# EasyEDA Pro project BackupProjects_muggle.eprj

# Schematic MSP430_T2_pro
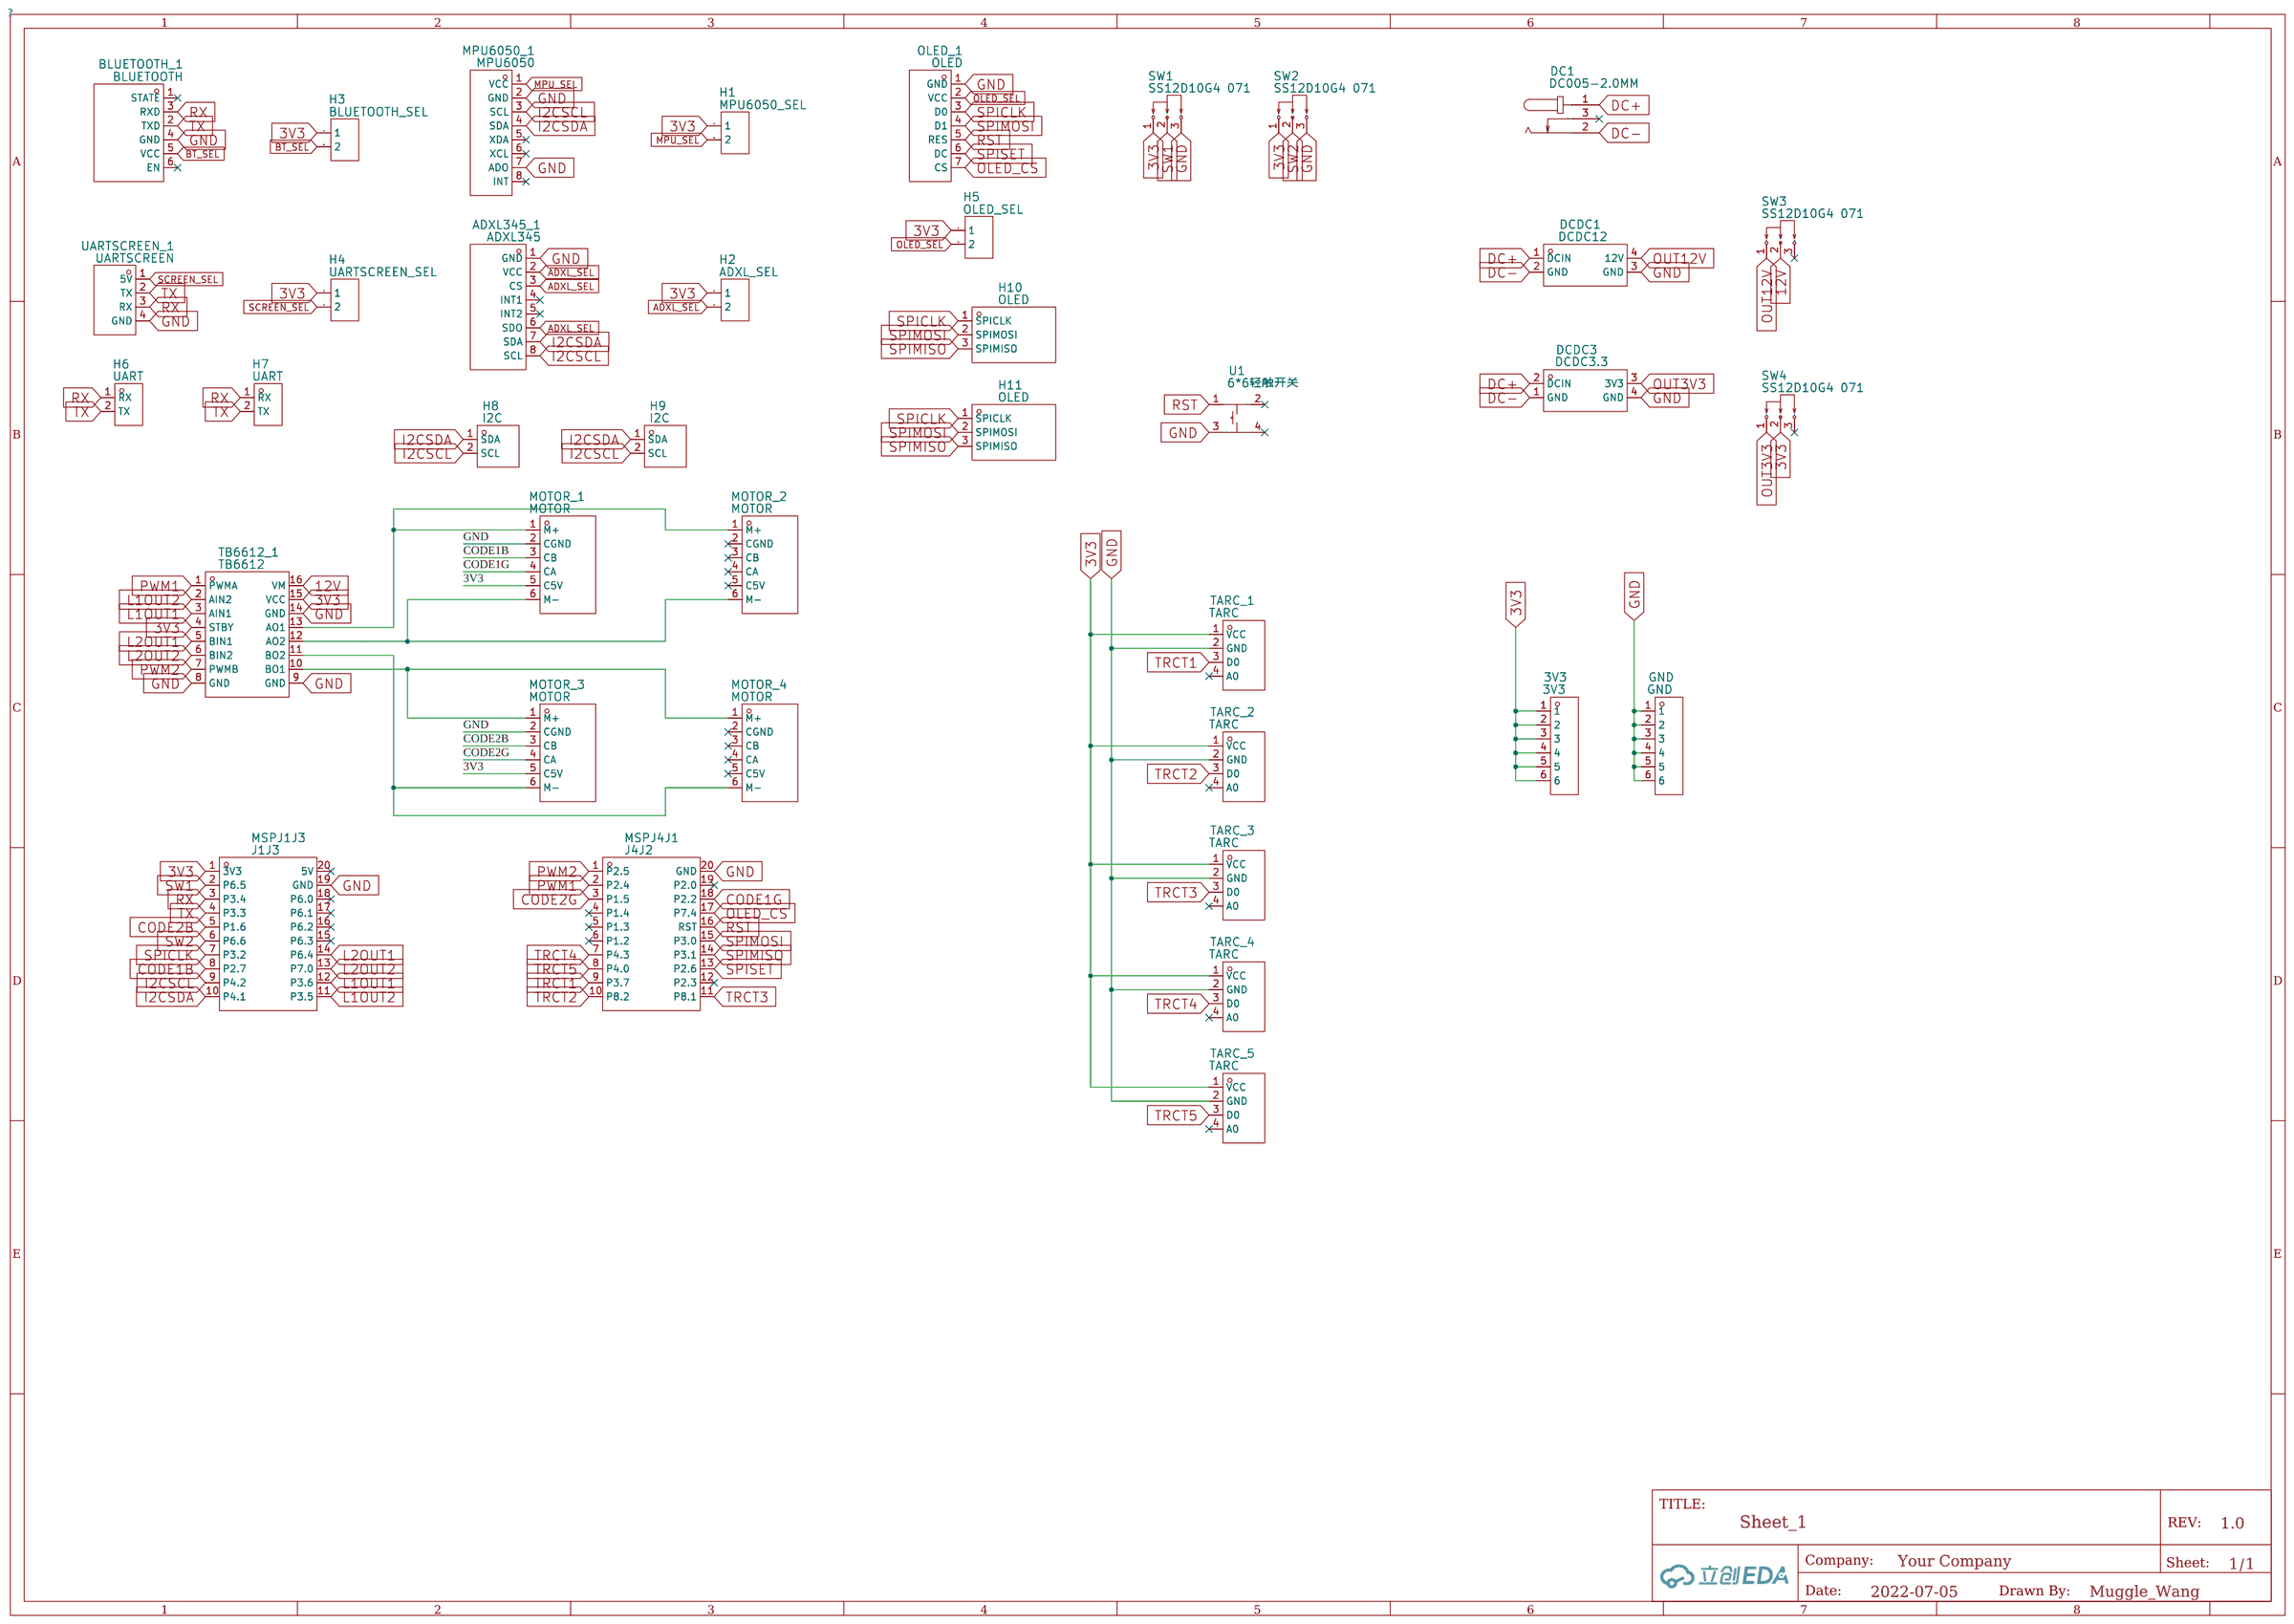
[diagram p0: schematic sheet]

## Parts
3V3  3V3  [DIP-6P]
ADXL345_1  ADXL345  [ADXL345加速度模块]
BLUETOOTH_1  BLUETOOTH  [HC05封装]
DC1  DC005-2.0MM  [DC-IN-TH_DC005-T20]
DCDC1  DCDC12  [15V-12V]
DCDC3  DCDC3.3  [15V-3.3V]
GND  GND  [DIP-6P]
H1  MPU6050_SEL  [HDR-F-2.54_1X2]
H2  ADXL_SEL  [HDR-F-2.54_1X2]
H3  BLUETOOTH_SEL  [HDR-F-2.54_1X2]
H4  UARTSCREEN_SEL  [HDR-F-2.54_1X2]
H5  OLED_SEL  [HDR-F-2.54_1X2]
H6  UART  [UART_2]
H7  UART  [UART_2]
H8  I2C  [DIP-2.54MM-2P]
H9  I2C  [DIP-2.54MM-2P]
H10  OLED  [SPI_3]
H11  OLED  [SPI_3]
MOTOR_1  MOTOR  [MOTOR]
MOTOR_2  MOTOR  [MOTOR]
MOTOR_3  MOTOR  [MOTOR]
MOTOR_4  MOTOR  [MOTOR]
MPU6050_1  MPU6050  [MPU6050模块]
MSPJ1J3  J1J3  [MSP_L]
MSPJ4J1  J4J2  [MSP_R]
OLED_1  OLED  [0.96OLED_7P]
SW1  SS12D10G4 071  [SW-TH_SHOU-HAN_SS12D10G4]
SW2  SS12D10G4 071  [SW-TH_SHOU-HAN_SS12D10G4]
SW3  SS12D10G4 071  [SW-TH_SHOU-HAN_SS12D10G4]
SW4  SS12D10G4 071  [SW-TH_SHOU-HAN_SS12D10G4]
TARC_1  TARC  [TARC]
TARC_2  TARC  [TARC]
TARC_3  TARC  [TARC]
TARC_4  TARC  [TARC]
TARC_5  TARC  [TARC]
TB6612_1  TB6612  [TB6612FNG]
U1  6*6轻触开关  [轻触开关6*6]
UARTSCREEN_1  UARTSCREEN  [UART_SCREEN]

## Library data of the parts
3V3 = 3V3
ADXL345_1 = ADXL345
BLUETOOTH_1 = BLUETOOTH
DC1 = DC005-2.0MM: link: https://atta.szlcsc.com/upload/public/pdf/source/20170519/1495157966733.pdf; Supplier: LCSC; Manufacturer: SOFNG; Supplier Part: C111567; JLCPCB Part Class: ExtendedPart
DCDC1 = DCDC12: link: https://item.szlcsc.com/213063.html
DCDC3 = DCDC3.3: link: https://item.szlcsc.com/213063.html
GND = GND
H1 = MPU6050_SEL: 3DModel: HDR-F-2.54_1x2; Supplier Part: C49661; Supplier: LCSC
H2 = ADXL_SEL: 3DModel: HDR-F-2.54_1x2; Supplier Part: C49661; Supplier: LCSC
H3 = BLUETOOTH_SEL: 3DModel: HDR-F-2.54_1x2; Supplier Part: C49661; Supplier: LCSC
H4 = UARTSCREEN_SEL: 3DModel: HDR-F-2.54_1x2; Supplier Part: C49661; Supplier: LCSC
H5 = OLED_SEL: 3DModel: HDR-F-2.54_1x2; Supplier Part: C49661; Supplier: LCSC
H6 H7 = UART
H8 H9 = I2C
H10 H11 = OLED
MOTOR_1-MOTOR_4 = MOTOR
MPU6050_1 = MPU6050
MSPJ1J3 = J1J3
MSPJ4J1 = J4J2
OLED_1 = OLED: link: https://cn.bing.com/search?q=datasheet：0.96OLED
SW1-SW4 = SS12D10G4 071: link: https://atta.szlcsc.com/upload/public/pdf/source/20210820/80D1704BBF3FCEE0435FCAA54C61E0A3.pdf; Supplier: LCSC; Supplier Part: C2887259; Manufacturer: SHOUHAN(首韩); Manufacturer Part: SS12D10G4071; JLCPCB Part Class: ExtendedPart
TARC_1-TARC_5 = TARC
TB6612_1 = TB6612
U1 = 6*6轻触开关
UARTSCREEN_1 = UARTSCREEN

## Nets
3V3: 3V3.1 3V3.2 3V3.3 3V3.4 3V3.5 3V3.6 H1.1 H2.1 H3.1 H4.1 H5.1 MOTOR_1.5(C5V) MOTOR_3.5(C5V) MSPJ1J3.1(3V3) SW1.1 SW2.1 SW4.2 TARC_1.1(VCC) TARC_2.1(VCC) TARC_3.1(VCC) TARC_4.1(VCC) TARC_5.1(VCC) TB6612_1.4(STBY) TB6612_1.15(VCC)
12V: SW3.2 TB6612_1.16(VM)
GND: ADXL345_1.1(GND) BLUETOOTH_1.4(GND) DCDC1.3(GND) DCDC3.4(GND) GND.1 GND.2 GND.3 GND.4 GND.5 GND.6 MOTOR_1.2(CGND) MOTOR_3.2(CGND) MPU6050_1.2(GND) MPU6050_1.7(ADO) MSPJ1J3.19(GND) MSPJ4J1.20(GND) OLED_1.1(GND) SW1.3 SW2.3 TARC_1.2(GND) TARC_2.2(GND) TARC_3.2(GND) TARC_4.2(GND) TARC_5.2(GND) TB6612_1.8(GND) TB6612_1.9(GND) TB6612_1.14(GND) U1.3 UARTSCREEN_1.4(GND)
ADXL_SEL: ADXL345_1.2(VCC) ADXL345_1.3(CS) ADXL345_1.6(SDO) H2.2
BT_SEL: BLUETOOTH_1.5(VCC) H3.2
CODE1B: MOTOR_1.3(CB) MSPJ1J3.8(P2.7)
CODE1G: MOTOR_1.4(CA) MSPJ4J1.18(P2.2)
CODE2B: MOTOR_3.3(CB) MSPJ1J3.5(P1.6)
CODE2G: MOTOR_3.4(CA) MSPJ4J1.3(P1.5)
DC+: DC1.1 DCDC1.1(DCIN) DCDC3.2(DCIN)
DC-: DC1.2 DCDC1.2(GND) DCDC3.1(GND)
I2CSCL: ADXL345_1.8(SCL) H8.2(SCL) H9.2(SCL) MPU6050_1.3(SCL) MSPJ1J3.9(P4.2)
I2CSDA: ADXL345_1.7(SDA) H8.1(SDA) H9.1(SDA) MPU6050_1.4(SDA) MSPJ1J3.10(P4.1)
L1OUT1: MSPJ1J3.12(P3.6) TB6612_1.3(AIN1)
L1OUT2: MSPJ1J3.11(P3.5) TB6612_1.2(AIN2)
L2OUT1: MSPJ1J3.14(P6.4) TB6612_1.5(BIN1)
L2OUT2: MSPJ1J3.13(P7.0) TB6612_1.6(BIN2)
MPU_SEL: H1.2 MPU6050_1.1(VCC)
OLED_CS: MSPJ4J1.17(P7.4) OLED_1.7(CS)
OLED_SEL: H5.2 OLED_1.2(VCC)
OUT3V3: DCDC3.3(3V3) SW4.1
OUT12V: DCDC1.4(12V) SW3.1
PWM1: MSPJ4J1.2(P2.4) TB6612_1.1(PWMA)
PWM2: MSPJ4J1.1(P2.5) TB6612_1.7(PWMB)
RST: MSPJ4J1.16(RST) OLED_1.5(RES) U1.1
RX: BLUETOOTH_1.3(RXD) H6.1(RX) H7.1(RX) MSPJ1J3.3(P3.4) UARTSCREEN_1.3(RX)
SCREEN_SEL: H4.2 UARTSCREEN_1.1(5V)
SPICLK: H10.1(SPICLK) H11.1(SPICLK) MSPJ1J3.7(P3.2) OLED_1.3(D0)
SPIMISO: H10.3(SPIMISO) H11.3(SPIMISO) MSPJ4J1.14(P3.1)
SPIMOSI: H10.2(SPIMOSI) H11.2(SPIMOSI) MSPJ4J1.15(P3.0) OLED_1.4(D1)
SPISET: MSPJ4J1.13(P2.6) OLED_1.6(DC)
SW1: MSPJ1J3.2(P6.5) SW1.2
SW2: MSPJ1J3.6(P6.6) SW2.2
TRCT1: MSPJ4J1.9(P3.7) TARC_1.3(D0)
TRCT2: MSPJ4J1.10(P8.2) TARC_2.3(D0)
TRCT3: MSPJ4J1.11(P8.1) TARC_3.3(D0)
TRCT4: MSPJ4J1.7(P4.3) TARC_4.3(D0)
TRCT5: MSPJ4J1.8(P4.0) TARC_5.3(D0)
TX: BLUETOOTH_1.2(TXD) H6.2(TX) H7.2(TX) MSPJ1J3.4(P3.3) UARTSCREEN_1.2(TX)
TB6612_1_10: MOTOR_3.1(M+) MOTOR_4.1(M+) TB6612_1.10(BO1)
TB6612_1_11: MOTOR_3.6(M-) MOTOR_4.6(M-) TB6612_1.11(BO2)
TB6612_1_12: MOTOR_1.6(M-) MOTOR_2.6(M-) TB6612_1.12(AO2)
TB6612_1_13: MOTOR_1.1(M+) MOTOR_2.1(M+) TB6612_1.13(AO1)

Not connected (* = marked no-connect by the designer): ADXL345_1 4(INT1)* 5(INT2)*; BLUETOOTH_1 1(STATE)* 6(EN)*; DC1 3*; MOTOR_2 2(CGND)* 3(CB)* 4(CA)* 5(C5V)*; MOTOR_4 2(CGND)* 3(CB)* 4(CA)* 5(C5V)*; MPU6050_1 5(XDA)* 6(XCL)* 8(INT)*; MSPJ1J3 15(P6.3)* 16(P6.2)* 17(P6.1)* 18(P6.0)* 20(5V)*; MSPJ4J1 4(P1.4)* 5(P1.3)* 6(P1.2)* 12(P2.3)* 19(P2.0)*; SW3 3*; SW4 3*; TARC_1 4(A0)*; TARC_2 4(A0)*; TARC_3 4(A0)*; TARC_4 4(A0)*; TARC_5 4(A0)*; U1 2* 4*

# Board 1-PCB_PCB_MSP430_T2 copy
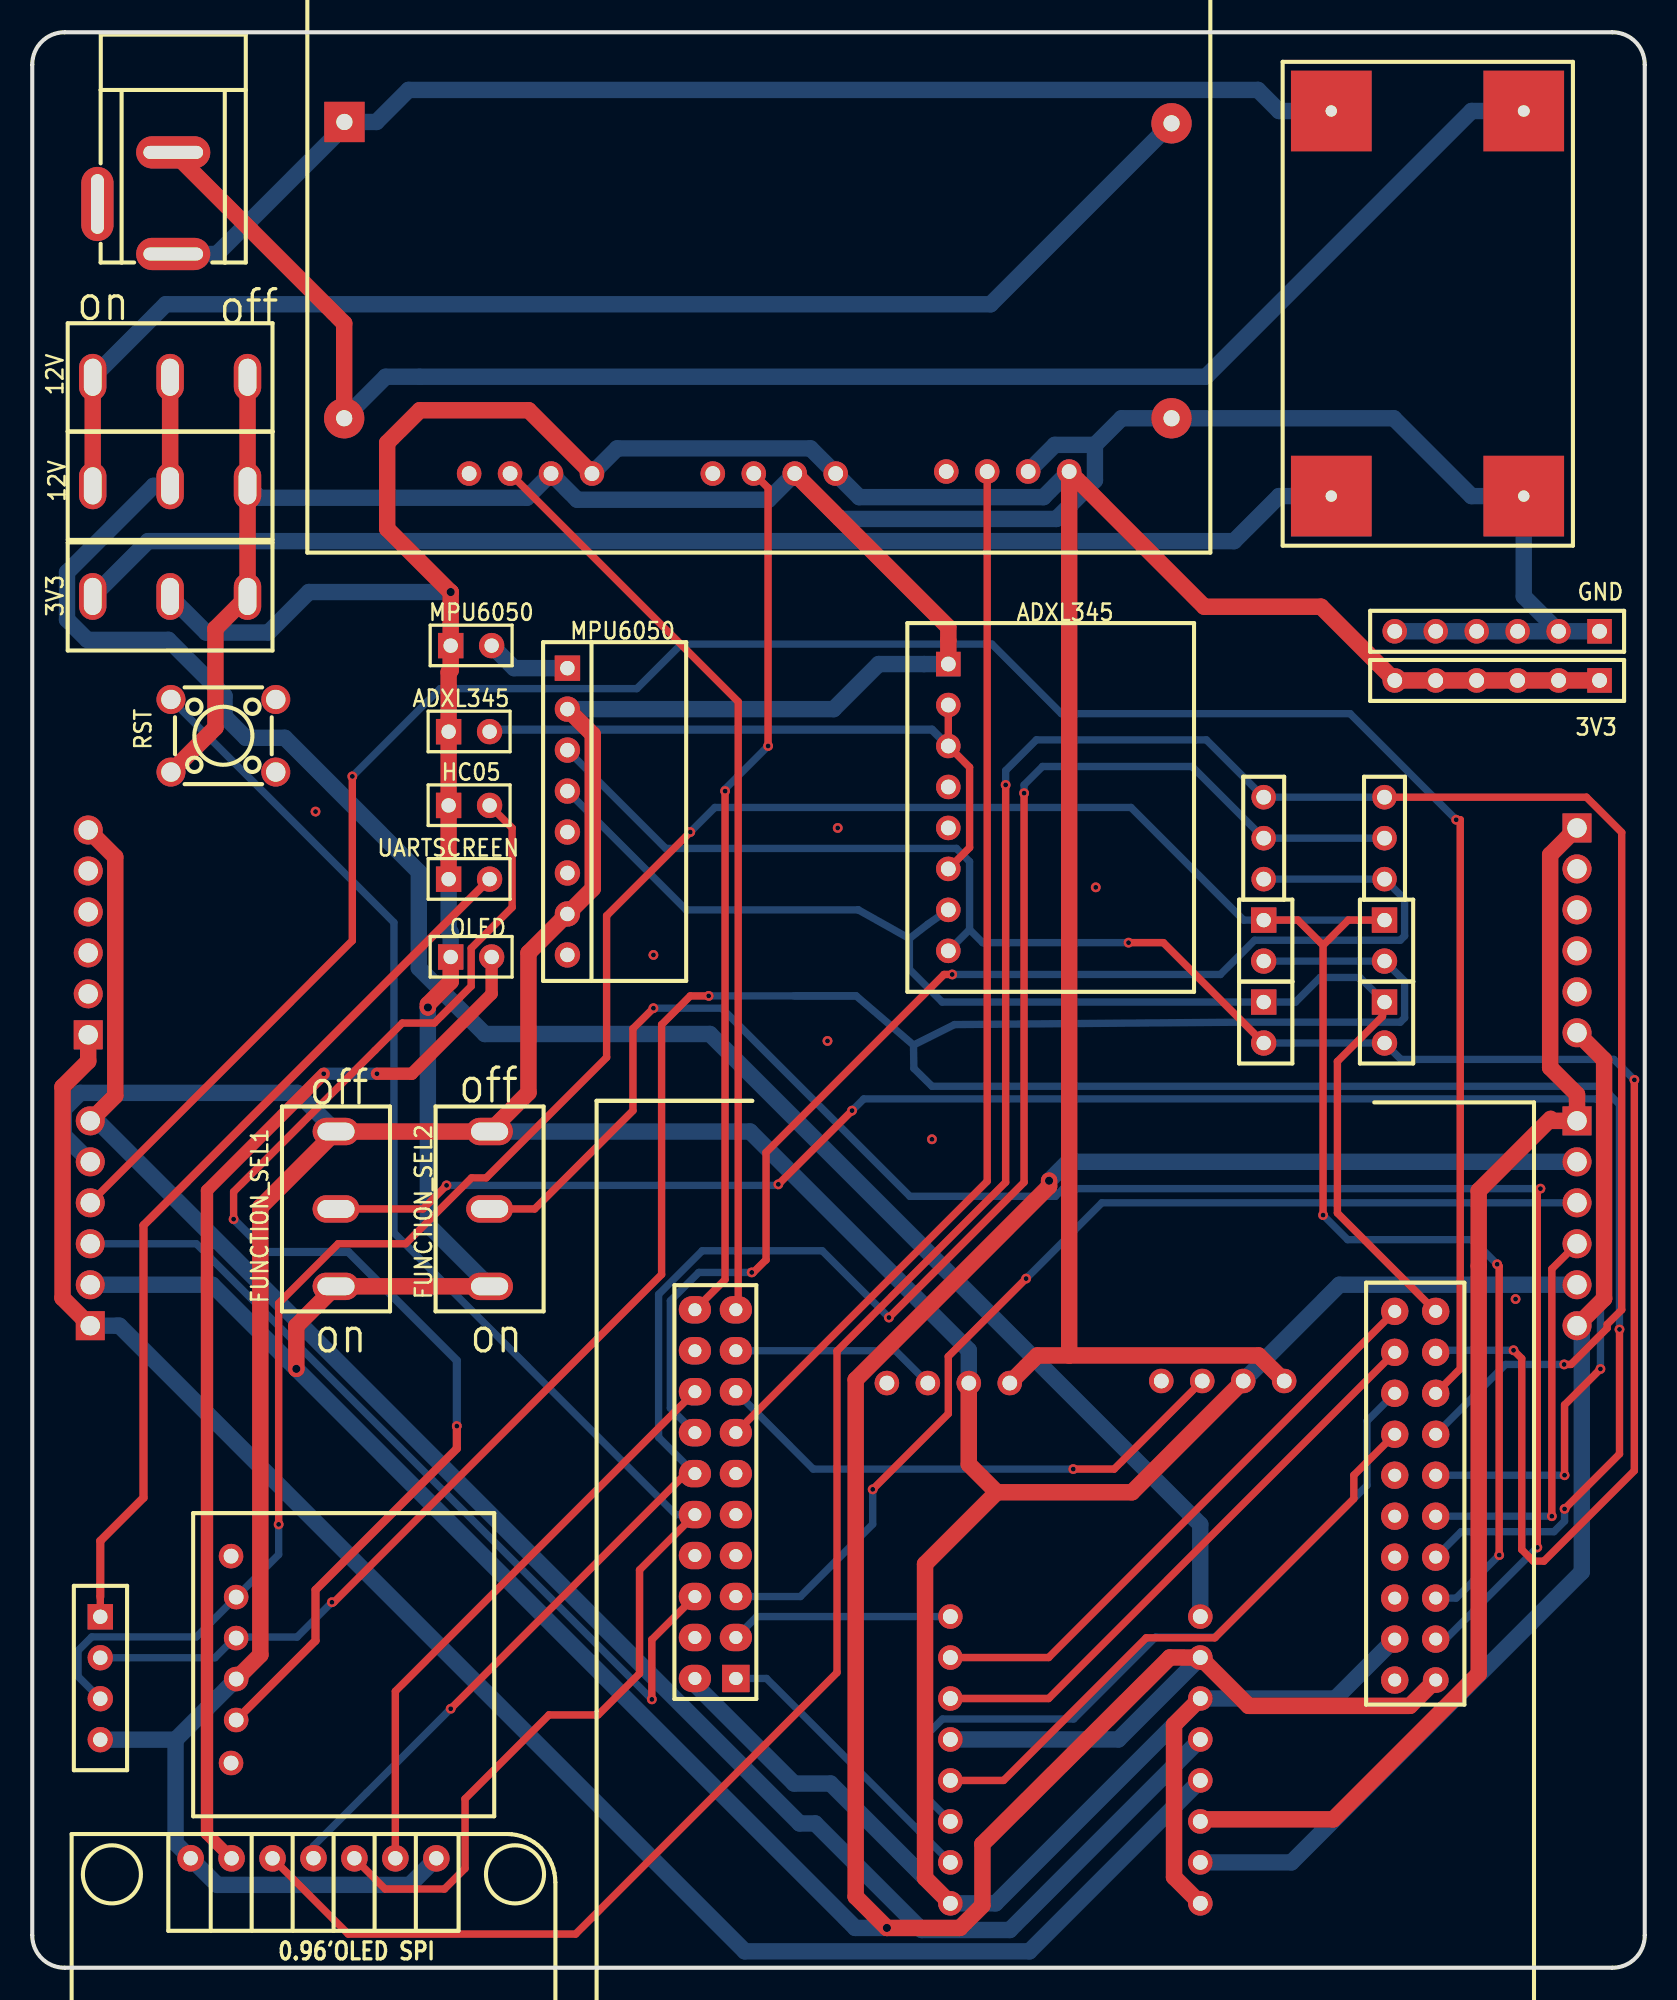
[diagram p1: board, top side]
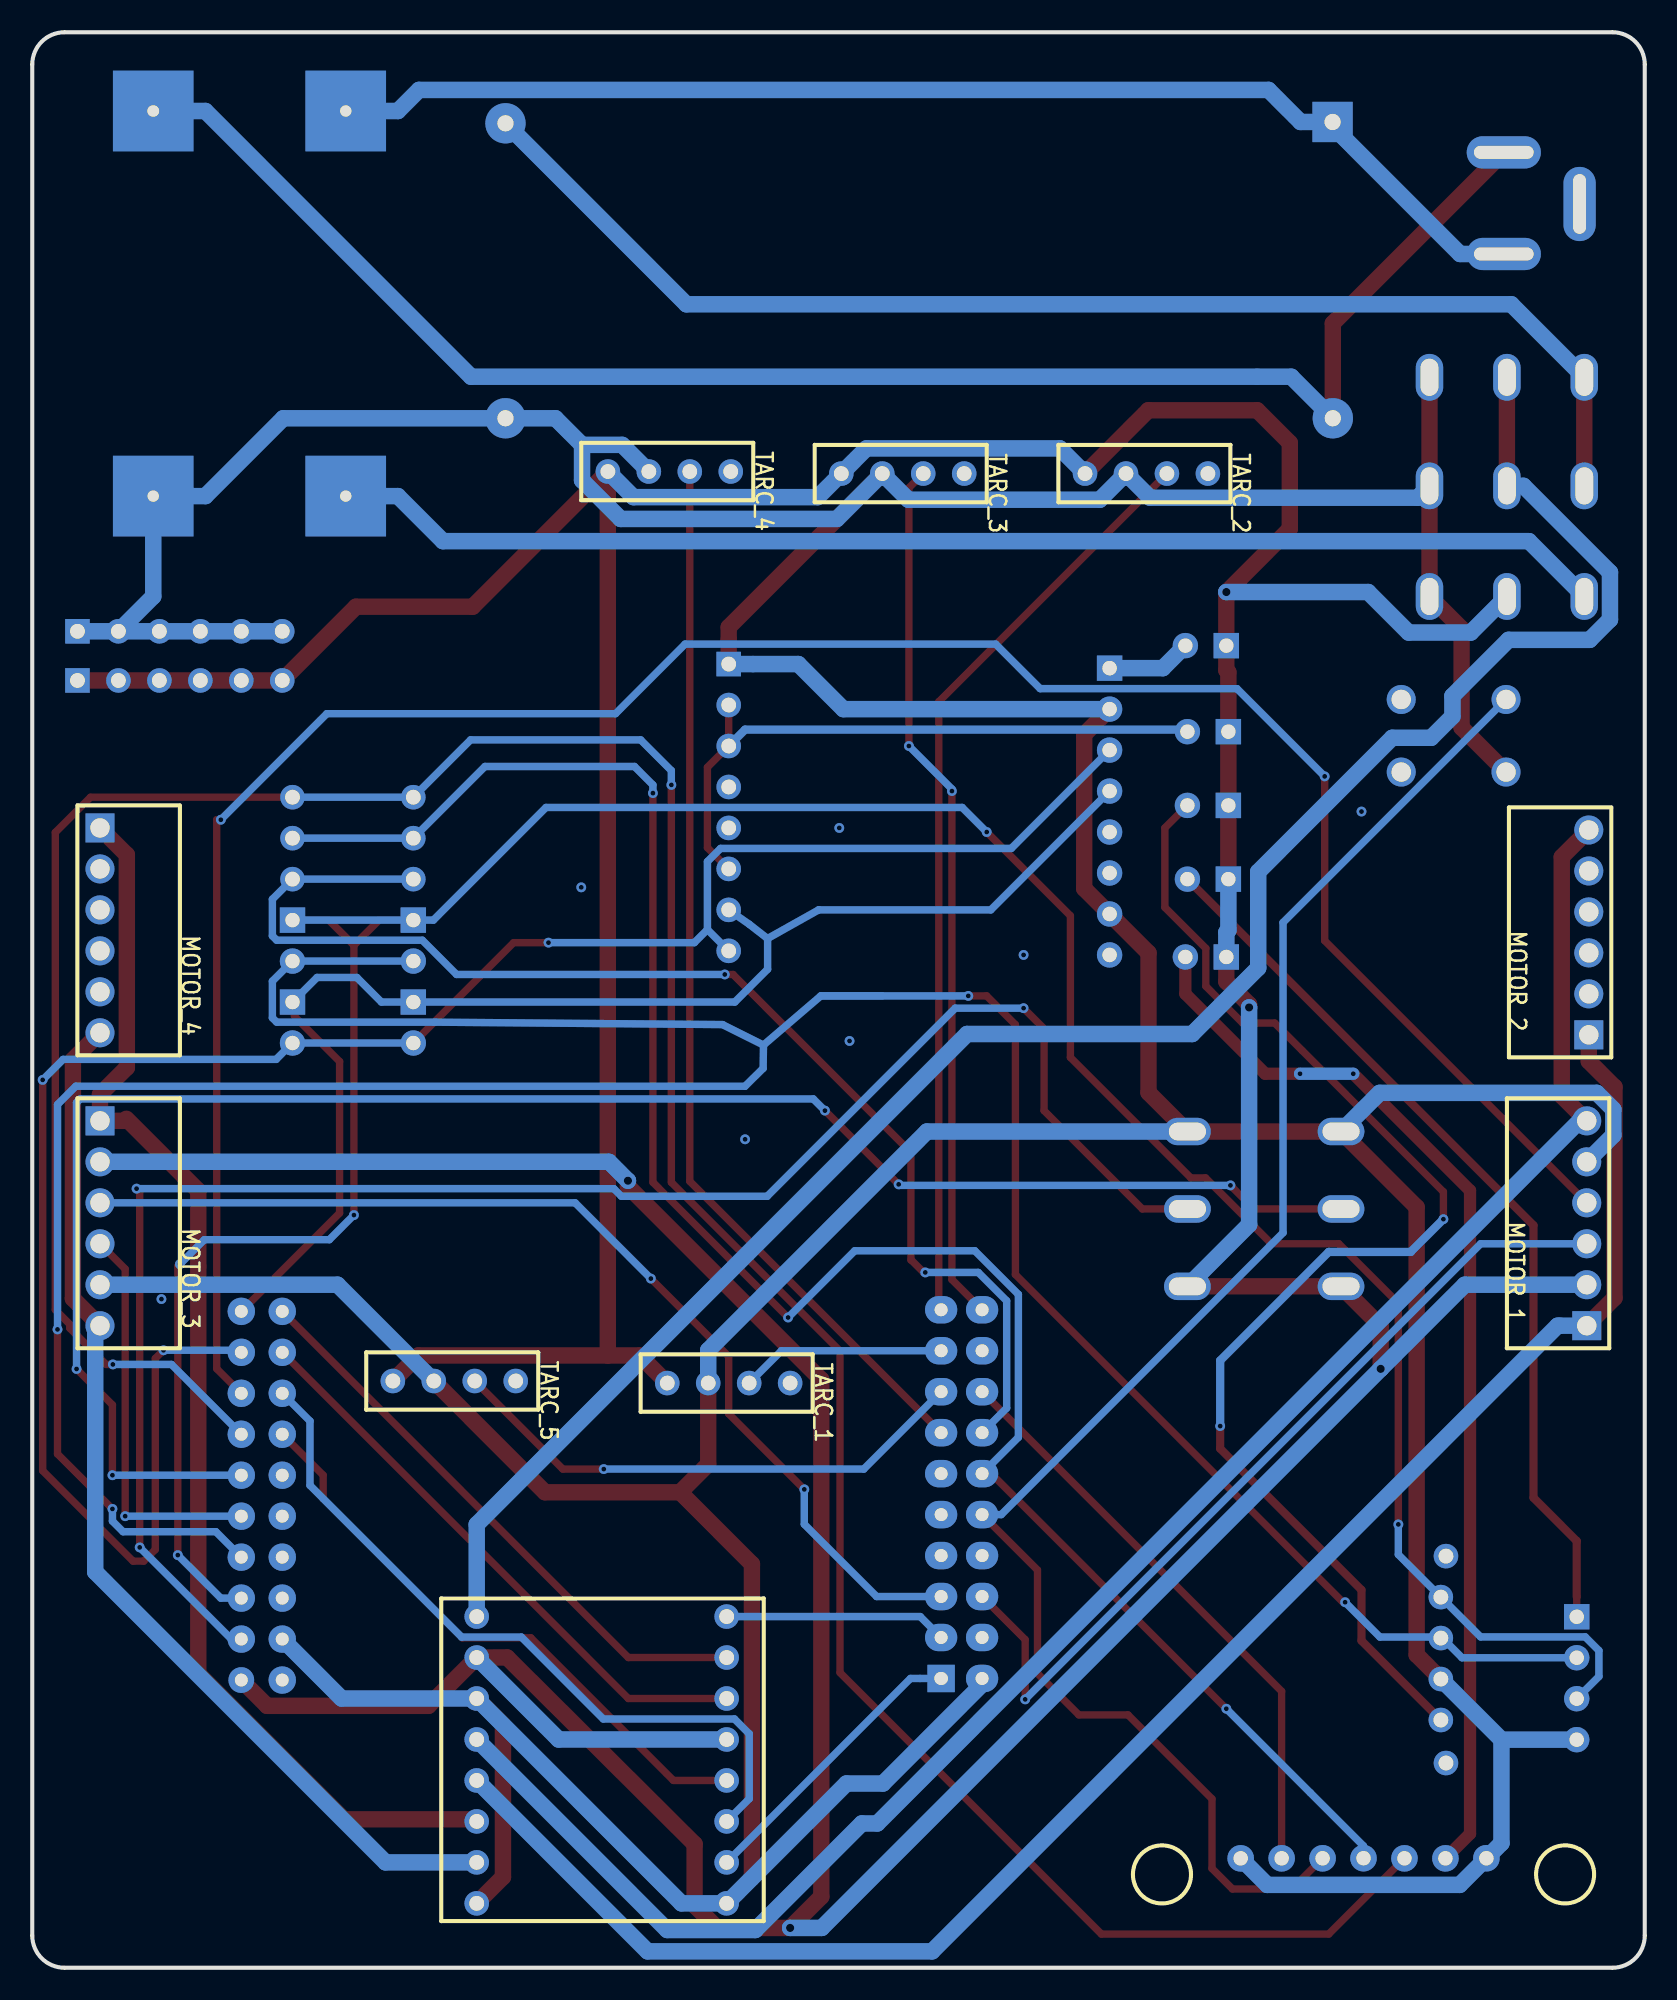
[diagram p2: board, bottom side, seen from below]

Outline 100 x 120 mm; copper layers: Top Layer, Bottom Layer. Coordinates in mm from the lower left corner of the outline.
Outline path: 0,118 arc(0.59,119.41) 2,120 98,120 arc(99.41,119.41) 100,118 100,2 arc(99.41,0.59) 98,0 2,0 arc(0.59,0.59) 0,2 0,118
Stack: Top Layer 0.035mm / Dielectric1 1.51mm FR4 er 4.5 / Bottom Layer 0.035mm

## Design rules (mm)
spacing Default (default): track to track 0.229, other pairs 0 to 0.229
spacing DY: track to track 0.229, other pairs 0 to 0.229
track width Default (default): min 0.457, default 0.457, max 25.4
track width DY: min 1.016, default 1.016, max 25.4
differential pair differentialPair (default): width min 0.127, default 0.254, max 2.54; gap min 0.152, default 0.152
via Default (default): diameter min 0.61, default 0.61, max 100.025; hole min 0.305, default 0.305, max 59.995
via DY: diameter min 0.61, default 0.61, max 100.025; hole min 0.305, default 0.305, max 59.995
net 3V3 uses DY
net TB6612_1_13 uses DY
net GND uses DY, gge38530
net 12V uses DY
net TB6612_1_11 uses DY
net TB6612_1_10 uses DY
net TB6612_1_12 uses DY
net OUT12V uses DY
net DC- uses DY
net OUT3V3 uses DY
net DC+ uses DY
pour e292 uses gge38542
pour e530 uses gge38530

## Placement (name value [footprint] x y rotation side)
3V3  3V3  [DIP-6P]  89.58 79.81 180 top
3V3#2  -  [SW-TH_SHOU-HAN_SS12D10G4]  8.55 85.02 0 top
12V  -  [SW-TH_SHOU-HAN_SS12D10G4]  8.55 98.61 0 top
12V#2  -  [SW-TH_SHOU-HAN_SS12D10G4]  8.55 91.88 0 top
ADXL345  -  [ADXL345加速度模块]  54.27 83.37 0 top
ADXL345#2  -  [HDR-F-2.54_1X2]  27.09 76.64 0 top
BLUETOOTH_1  BLUETOOTH  [HC05封装]  12.49 19.11 0 top
DC1  DC005-2.0MM  [DC-IN-TH_DC005-T20]  6.39 109.4 270 top
DCDC1  DCDC12  [15V-12V]  17.06 122.74 0 top
DCDC3  DCDC3.3  [15V-3.3V]  83.86 104.45 270 top
FUNCTION_SEL1  SS12D10G4 071  [SW-TH_SHOU-HAN_SS12D10G4]  18.84 47.05 90 top
FUNCTION_SEL2  SS12D10G4 071  [SW-TH_SHOU-HAN_SS12D10G4]  28.36 47.05 90 top
GND  GND  [DIP-6P]  89.58 82.86 180 top
H6  UART  [UART_2]  76.37 63.68 270 top
H7  UART  [UART_2]  83.86 63.68 270 top
H8  I2C  [DIP-2.54MM-2P]  76.37 58.6 270 top
H9  I2C  [DIP-2.54MM-2P]  83.86 58.6 270 top
H10  OLED  [SPI_3]  76.37 70.03 270 top
H11  OLED  [SPI_3]  83.86 70.03 270 top
HC05  BLUETOOTH_SEL  [HDR-F-2.54_1X2]  27.09 72.06 0 top
MOTOR_1  -  [MOTOR]  3.6 46.16 270 bottom
MOTOR_2  -  [MOTOR]  3.47 64.19 270 bottom
MOTOR_3  -  [MOTOR]  95.8 46.16 90 bottom
MOTOR_4  -  [MOTOR]  95.8 64.32 90 bottom
MPU6050  -  [HDR-F-2.54_1X2]  27.22 81.97 0 top
MPU6050#2  -  [MPU6050模块]  33.19 62.79 0 top
MSPJ1J3  J1J3  [MSP_L]  83.23 29.27 180 top
MSPJ4J1  J4J2  [MSP_R]  43.63 17.94 180 top
OLED  OLED_SEL  [HDR-F-2.54_1X2]  27.22 62.67 0 top
OLED_1  OLED  [0.96OLED_7P]  17.44 6.79 0 top
RST  6*6轻触开关  [轻触开关6*6]  11.85 76.38 0 top
TARC_1  -  [TARC]  56.81 36.25 90 bottom
TARC_2  -  [TARC]  30.9 92.64 90 bottom
TARC_3  -  [TARC]  46.01 92.64 90 bottom
TARC_4  -  [TARC]  60.49 92.77 90 bottom
TARC_5  -  [TARC]  73.83 36.38 90 bottom
TB6612_1  TB6612  [TB6612FNG]  56.94 3.99 0 bottom
UARTSCREEN  UARTSCREEN_SEL  [HDR-F-2.54_1X2]  27.09 67.49 0 top
UARTSCREEN_1  UARTSCREEN  [UART_SCREEN]  3.85 18.34 0 top

## Footprints (pads in the part's own frame, mm; a bottom-side part is the same pattern mirrored in y, then rotated)
0.96OLED_7P
  round 1.65 hole 0.89: 1(-7.619,0.002) 2(-5.079,-0.004) 3(-2.538,-0.004) 4(0.002,0.004) 5(2.538,-0.002) 6(5.079,-0.002) 7(7.619,-0.004)
15V-3.3V
  rect 5x5 hole 0.7: 1(-10.668,-3.302) 3(13.208,8.636) 4(13.208,-3.302)
  rect 5x5 hole 0.7x0.735: 2(-10.668,8.636)
15V-12V
  rect 2.5x2.5 hole 1: 1(2.3,-8.3)
  round 2.5 hole 1: 2(2.286,-26.67) 3(53.594,-26.67) 4(53.594,-8.382)
ADXL345加速度模块
  rect 1.524x1.524 hole 0.914: 1(2.54,-2.54)
  round 1.524 hole 0.914: 2(2.54,-5.08) 3(2.54,-7.62) 4(2.54,-10.16) 5(2.54,-12.7) 6(2.54,-15.24) 7(2.54,-17.78) 8(2.54,-20.32)
DC-IN-TH_DC005-T20
  oval 2x4.6 hole 0.8x3.7: 1(3.15,2.35) 2(-3.15,2.35)
  oval 4.6x2 hole 3.7x0.8: 3(0.05,-2.35)
DIP-2.54MM-2P
  rect 1.575x1.575 hole 0.889: 1(-1.27,0)
  round 1.575 hole 0.889: 2(1.27,0)
DIP-6P
  rect 1.524x1.524 hole 0.914: 1(-7.62,0)
  round 1.524 hole 0.914: 2(-5.08,0) 3(-2.54,0) 4(0,0) 5(2.54,0) 6(5.08,0)
HC05封装
  round 1.524 hole 0.914: 1(-0.159,6.413) 2(0.159,3.873) 3(0.159,1.333) 4(0.159,-1.206) 5(0.159,-3.747) 6(-0.159,-6.413)
HDR-F-2.54_1X2
  rect 1.575x1.575 hole 0.889: 1(-1.27,0)
  round 1.575 hole 0.889: 2(1.27,0)
MOTOR
  round 1.8 hole 1.2: 1(-6.35,0) 2(-3.81,0) 3(-1.27,0) 4(1.27,0) 5(3.81,0)
  rect 1.8x1.8 hole 1.2: 6(6.35,0)
MPU6050模块
  rect 1.575x1.575 hole 0.889x0.894: 1(0,17.78)
  round 1.575 hole 0.889x0.894: 2(0,15.24) 3(0,12.7) 4(0,10.16) 5(0,7.62) 6(0,5.08) 7(0,2.54) 8(0,0)
MSP_L
  round 1.6 hole 0.8: 1(-3.81,11.43)
  round 1.7 hole 0.8: 2(-3.81,8.89) 3(-3.81,6.35) 4(-3.81,3.81) 5(-3.81,1.27) 6(-3.81,-1.27) 7(-3.81,-3.81) 8(-3.81,-6.35) 9(-3.81,-8.89) 10(-3.81,-11.43) 11(-1.27,-11.43) 12(-1.27,-8.89) 13(-1.27,-6.35) 14(-1.27,-3.81) 15(-1.27,-1.27) 16(-1.27,1.27) 17(-1.27,3.81) 18(-1.27,6.35) 19(-1.27,8.89) 20(-1.27,11.43)
MSP_R
  rect 1.7x1.7 hole 0.84x0.8: 1(0,0)
  oval 2x1.7 hole 0.805x0.8: 2(0,-2.54) 3(0,-5.08) 4(0,-7.62) 5(0,-10.16) 6(0,-12.7) 7(0,-15.24) 8(0,-17.78) 9(0,-20.32) 10(0,-22.86) 11(2.54,-22.86) 12(2.54,-20.32) 13(2.54,-17.78) 14(2.54,-15.24) 15(2.54,-12.7) 16(2.54,-10.16) 17(2.54,-7.62) 18(2.54,-5.08) 19(2.54,-2.54) 20(2.54,0)
SPI_3
  round 1.524 hole 0.914: 1(-2.54,0) 2(0,0) 3(2.54,0)
SW-TH_SHOU-HAN_SS12D10G4
  oval 1.7x2.9 hole 1.1x2.3: 1(-4.8,0) 2(0,0) 3(4.8,0)
TARC
  round 1.524 hole 0.914: 1(0,3.81) 2(0,1.27) 3(0,-1.27) 4(0,-3.81)
TB6612FNG
  round 1.524 hole 0.919x0.914: 1(0,-17.78) 2(0,-15.24) 3(0,-12.7) 4(0,-10.16) 5(0,-7.62) 6(0,-5.08) 7(0,-2.54) 8(0,0) 9(15.5,0) 10(15.5,-2.54) 11(15.5,-5.08) 12(15.5,-7.62) 13(15.5,-10.16) 14(15.5,-12.7) 15(15.5,-15.24) 16(15.5,-17.78)
UART_2
  rect 1.575x1.575 hole 0.889: 1(-1.27,0)
  round 1.575 hole 0.889: 2(1.27,0)
UART_SCREEN
  rect 1.575x1.575 hole 0.889: 1(0.368,3.417)
  round 1.575 hole 0.889: 2(0.368,0.876) 3(0.368,-1.663) 4(0.368,-4.204)
轻触开关6*6
  round 1.8 hole 1.2: 1(-3.25,2.25) 2(3.25,2.25) 3(-3.25,-2.25) 4(3.25,-2.25)

## Nets
3V3: 3V3.1 3V3.2 3V3.3 3V3.4 3V3.5 3V3.6 3V3#2.2 ADXL345#2.1 FUNCTION_SEL1.1 FUNCTION_SEL2.1 HC05.1 MOTOR_1.5 MOTOR_3.5 MPU6050.1 MSPJ1J3.1 OLED.1 TARC_1.1 TARC_2.1 TARC_3.1 TARC_4.1 TARC_5.1 TB6612_1.4 TB6612_1.15 UARTSCREEN.1
12V: 12V.2 12V#2.2 TB6612_1.16
GND: 3V3#2.3 12V.3 12V#2.3 ADXL345.1 BLUETOOTH_1.4 DCDC1.3 DCDC3.3 FUNCTION_SEL1.3 FUNCTION_SEL2.3 GND.1 GND.2 GND.3 GND.4 GND.5 GND.6 MOTOR_1.2 MOTOR_3.2 MPU6050#2.2 MPU6050#2.7 MSPJ1J3.19 MSPJ4J1.20 OLED_1.1 OLED_1.7 RST.3 TARC_1.2 TARC_2.2 TARC_3.2 TARC_4.2 TARC_5.2 TB6612_1.8 TB6612_1.9 TB6612_1.14 UARTSCREEN_1.4
ADXL_SEL: ADXL345.2 ADXL345.3 ADXL345.6 ADXL345#2.2
BT_SEL: BLUETOOTH_1.5 HC05.2
CODE1B: MOTOR_1.3 MSPJ1J3.8
CODE1G: MOTOR_1.4 MSPJ4J1.18
CODE2B: MOTOR_3.3 MSPJ1J3.5
CODE2G: MOTOR_3.4 MSPJ4J1.3
DC+: DC1.1 DCDC1.1 DCDC3.1
DC-: DC1.2 DCDC1.2 DCDC3.2
I2CSCL: ADXL345.8 H8.2 H9.2 MPU6050#2.3 MSPJ1J3.9
I2CSDA: ADXL345.7 H8.1 H9.1 MPU6050#2.4 MSPJ1J3.10
L1OUT1: MSPJ1J3.12 TB6612_1.3
L1OUT2: MSPJ1J3.11 TB6612_1.2
L2OUT1: MSPJ1J3.14 TB6612_1.5
L2OUT2: MSPJ1J3.13 TB6612_1.6
MPU_SEL: MPU6050.2 MPU6050#2.1
OLED_SEL: OLED.2 OLED_1.2
OUT3V3: 3V3#2.1 DCDC3.4
OUT12V: 12V.1 12V#2.1 DCDC1.4
PWM1: MSPJ4J1.2 TB6612_1.1
PWM2: MSPJ4J1.1 TB6612_1.7
RST: MSPJ4J1.16 OLED_1.5 RST.1
RX: BLUETOOTH_1.2 H6.1 H7.1 MSPJ1J3.3 UARTSCREEN_1.3
SCREEN_SEL: UARTSCREEN.2 UARTSCREEN_1.1
SPICLK: H10.1 H11.1 MSPJ1J3.7 OLED_1.3
SPIMISO: H10.3 H11.3 MSPJ4J1.14
SPIMOSI: H10.2 H11.2 MSPJ4J1.15 OLED_1.4
SPISET: MSPJ4J1.13 OLED_1.6
SW1: FUNCTION_SEL2.2 MSPJ1J3.2
SW2: FUNCTION_SEL1.2 MSPJ1J3.6
TB6612_1_10: MOTOR_3.1 MOTOR_4.1 TB6612_1.10
TB6612_1_11: MOTOR_3.6 MOTOR_4.6 TB6612_1.11
TB6612_1_12: MOTOR_1.6 MOTOR_2.6 TB6612_1.12
TB6612_1_13: MOTOR_1.1 MOTOR_2.1 TB6612_1.13
TRCT1: MSPJ4J1.9 TARC_1.3
TRCT2: MSPJ4J1.10 TARC_2.3
TRCT3: MSPJ4J1.11 TARC_3.3
TRCT4: MSPJ4J1.7 TARC_4.3
TRCT5: MSPJ4J1.8 TARC_5.3
TX: BLUETOOTH_1.3 H6.2 H7.2 MSPJ1J3.4 UARTSCREEN_1.2

Pads without a net: ADXL345 4 5; BLUETOOTH_1 1 6; DC1 3; MOTOR_2 2 3 4 5; MOTOR_4 2 3 4 5; MPU6050#2 5 6 8; MSPJ1J3 15 16 17 18 20; MSPJ4J1 4 5 6 12 17 19; RST 2 4; TARC_1 4; TARC_2 4; TARC_3 4; TARC_4 4; TARC_5 4

## Via types
v1: diameter 1.016, hole 0.508, Top Layer to Bottom Layer, 5 vias
v2: diameter 0.61, hole 0.305, Top Layer to Bottom Layer, 47 vias

## Routing (per net, layer and track width the routed paths; a pad name or vN(x,y) marks a point on that pad's centre or on a via; arc(x,y) is an arc through that point)
3V3: length 463.9
  Top Layer w1.016: MSPJ1J3.1 85.44,16.24 75.43,16.24 TB6612_1.15 70.55,19.24 58.92,7.67 58.92,3.86 57.53,2.47 v1(53,2.47) 51.07,4.4 51.07,36.46 63.06,48.45 v1(63.06,48.8) ; 64.31,37.96 76.05,37.96 TARC_5.1 ; 64.31,37.96 64.31,92.76 TARC_4.1 72.69,84.38 79.92,84.38 3V3.6 3V3.5 3V3.4 3V3.3 3V3.2 3V3.1 ; 64.31,37.96 62.33,37.96 TARC_1.1 ; TARC_2.1 30.79,96.56 24.03,96.56 22.01,94.54 22.01,89.21 25.95,85.27 MPU6050.1 25.95,80.45 25.82,80.32 ADXL345#2.1 HC05.1 UARTSCREEN.1 ; FUNCTION_SEL2.1 FUNCTION_SEL1.1 16.38,39.79 v1(16.38,37.13) ; OLED.1 25.95,61.14 24.54,59.73 v1(24.54,59.54)
  Bottom Layer w1.016: TARC_4.1 62.71,91.18 51.29,91.18 TARC_3.1 48.26,94.2 36.27,94.2 TARC_2.1 ; TB6612_1.15 67.36,14.15 TB6612_1.4 ; v1(53,2.47) 51.04,2.47 v1(16.38,37.13) 11.16,42.35 MOTOR_1.5 ; v1(24.54,59.54) 24.54,46.07 FUNCTION_SEL2.1 ; MOTOR_3.5 64.23,49.97 v1(63.06,48.8) ; v1(25.95,85.29) 17.15,85.29 14.64,82.78 10.79,82.78 3V3#2.2 ; OLED.1 25.95,64.19 25.82,64.32 UARTSCREEN.1
12V: length 121.7
  Top Layer w1.016: 12V#2.2 12V.2
  Bottom Layer w1.016: TB6612_1.16 72.44,27.48 42.03,57.89 28.07,57.89 23.97,61.99 23.97,67.94 15.66,76.26 13.25,76.26 11.93,77.58 11.93,78.85 8.45,82.33 3.41,82.33 2.16,83.58 2.16,86.52 7.52,91.88 12V#2.2
GND: length 498.7
  Top Layer w1.016: TB6612_1.14 70.81,15.06 70.81,5.62 TB6612_1.9 ; MPU6050#2.2 34.76,76.46 34.76,66.91 MPU6050#2.7 30.78,62.92 30.78,54.26 FUNCTION_SEL2.3 FUNCTION_SEL1.3 14.15,47.16 14.15,19.4 BLUETOOTH_1.4 ; 12V.3 12V#2.3 3V3#2.3 11.36,83.03 11.36,76.89 RST.3 ; TARC_1.2 58.08,31.22 59.82,29.48 ; 59.82,29.48 55.37,25.03 55.37,5.56 TB6612_1.8 ; 59.82,29.48 68.2,29.48 TARC_5.2 ; TARC_3.2 56.81,83.11 56.81,82.33 ; ADXL345.1 56.81,82.33
  Bottom Layer w1.016: OLED_1.1 8.89,7.72 8.89,14.14 ; 65.9,94.42 63.41,94.42 TARC_4.2 ; 65.9,94.42 67.56,96.07 DCDC1.3 84.43,96.07 89.26,91.24 DCDC3.3 92.5,85.02 GND.2 ; 65.9,94.42 65.9,92.22 63.51,89.82 50.1,89.82 TARC_3.2 45.66,91.02 33.8,91.02 TARC_2.2 30.67,91.14 14.09,91.14 12V#2.3 ; 25.06,6.78 23.41,5.14 11.47,5.14 9.82,6.79 ; FUNCTION_SEL2.3 44.52,51.85 58.08,38.28 TARC_1.2 ; TARC_5.2 81.07,42.35 MOTOR_3.2 ; GND.1 GND.2 ; GND.2 GND.3 GND.4 GND.5 GND.6 ; MPU6050#2.2 49.7,78.03 52.49,80.83 55.31,80.83 ; MOTOR_1.2 1.95,51.61 1.95,53.22 2.97,54.24 16.44,54.24 FUNCTION_SEL1.3 ; 8.89,14.14 BLUETOOTH_1.4 ; 8.89,14.14 UARTSCREEN_1.4 ; ADXL345.1 55.31,80.83 ; MSPJ4J1.20 41.09,17.57 47.24,11.42 49.51,11.42 TB6612_1.8 59.74,3.99 TB6612_1.14 80.81,16.69 MSPJ1J3.19
  vias: v2(17.57,71.68) v2(38.52,62.79) v2(49.32,57.46) v2(49.95,70.67) v2(55.79,51.36) v2(65.95,66.98) v2(91.99,41.46)
ADXL_SEL: length 40.2
  Top Layer w0.457: ADXL345.6 58.13,69.45 58.13,74.43 ADXL345.3 ADXL345.2
  Bottom Layer w0.508: ADXL345.3 55.79,76.76 28.49,76.76 ADXL345#2.2
BT_SEL: length 80
  Top Layer w0.457: HC05.2 29.76,70.67 29.76,65.74 27.22,63.2 27.22,60.85 24.94,58.57 22.95,58.57 12.49,48.11 v2(12.49,46.41)
  Top Layer w0.508: BLUETOOTH_1.5 17.57,20.28 17.57,23.42 26.33,32.19 v2(26.33,33.58)
  Bottom Layer w0.508: v2(26.33,33.58) 26.33,37.65 19.6,44.38 14.52,44.38 v2(12.49,46.41)
CODE1B: length 146
  Top Layer w0.457: 3.6,47.43 19.85,63.68 v2(19.85,73.86) ; MSPJ1J3.8 88.56,37.14 88.56,71.18 v2(88.31,71.18)
  Bottom Layer w0.457: v2(19.85,73.86) 25.29,79.3 37.49,79.3 40.25,82.06 59.51,82.06 63.82,77.75 81.73,77.75 v2(88.31,71.18)
CODE1G: length 54
  Top Layer w0.457: v2(38.42,16.64) 38.42,20.34 MSPJ4J1.18
  Bottom Layer w0.457: MOTOR_1.4 10.18,44.89 v2(38.42,16.64)
CODE2B: length 24.7
  Top Layer w0.457: MOTOR_3.3 94.24,43.33 v2(94.24,28)
  Bottom Layer w0.457: v2(94.24,28) MSPJ1J3.5
CODE2G: length 65.6
  Top Layer w0.457: v2(61.64,42.73) 56.81,37.9 56.81,34.35 v2(52.12,29.66)
  Bottom Layer w0.457: 52.12,29.66 52.12,27.5 47.64,23.01 MSPJ4J1.3 ; 95.8,47.43 66.34,47.43 v2(61.64,42.73)
DC+: length 76.9
  Bottom Layer w1.016: 19.64,114.44 21.35,114.44 23.33,116.43 76.01,116.43 77.32,115.12 DCDC3.1 ; 19.64,114.44 DCDC1.1 ; 19.64,114.44 11.45,106.25 DC1.1
DC-: length 101.9
  Top Layer w1.016: DCDC1.2 19.34,101.95 8.74,112.55
  Bottom Layer w1.016: DCDC3.2 89.26,115.12 72.78,98.64 21.92,98.64 DCDC1.2
I2CSCL: length 130.3
  Top Layer w0.457: H8.2 70.15,63.56 v2(67.99,63.56) ; v2(99.35,55.05) 99.35,30.82 93.75,25.21 93.09,25.21 92.37,25.93 92.37,37.78 v2(91.86,38.28)
  Bottom Layer w0.457: ADXL345.8 58.13,64.37 58.13,68.58 57.31,69.4 39.28,69.4 MPU6050#2.3 ; 58.13,64.37 58.94,63.56 v2(67.99,63.56) ; v2(99.35,55.05) 98.09,56.32 84.88,56.32 H9.2 H8.2 ; MSPJ1J3.9 87.16,38.28 v2(91.86,38.28)
I2CSDA: length 84.1
  Top Layer w0.457: H9.1 83.73,58.98 80.94,56.19 80.94,46.79 MSPJ1J3.10
  Bottom Layer w0.457: 51.23,65.59 40.55,65.59 MPU6050#2.4 ; 51.23,65.59 54.4,63.81 ; 51.23,65.59 51.22,65.59 ; ADXL345.7 55.54,64.7 54.4,63.81 ; 54.4,63.81 54.4,61.91 56.43,59.87 H8.1 78.34,59.87 79.87,61.4 82.34,61.4 H9.1
L1OUT1: length 36.4
  Top Layer w0.457: MSPJ1J3.12 63.03,16.69 TB6612_1.3
L1OUT2: length 36.4
  Top Layer w0.457: TB6612_1.2 63.03,19.23 MSPJ1J3.11
L2OUT1: length 37.3
  Top Layer w0.457: TB6612_1.5 60.24,11.61 69.08,20.45 73.33,20.45 81.96,29.08 81.96,30.54 MSPJ1J3.14
L2OUT2: length 46.1
  Bottom Layer w0.457: MSPJ1J3.13 82.78,33.9 82.78,29.91 73.37,20.5 69.67,20.5 64.59,15.42 56.45,15.42 55.53,14.51 55.53,10.47 TB6612_1.6
MPU_SEL: length 5.3
  Bottom Layer w1.016: MPU6050.2 29.89,80.57 MPU6050#2.1
OLED_SEL: length 67
  Top Layer w0.762: v2(18.08,55.43) 10.84,48.19 10.84,8.31 12.36,6.78 ; OLED.2 28.49,60.38 23.54,55.43 v2(21.38,55.43)
  Bottom Layer w0.762: v2(21.38,55.43) v2(18.08,55.43)
OUT3V3: length 79.4
  Bottom Layer w1.016: 3V3#2.1 7.18,88.45 74.53,88.45 77.32,91.24 DCDC3.4
OUT12V: length 80.2
  Top Layer w1.016: 12V#2.1 12V.1
  Bottom Layer w1.016: 12V.1 8.28,103.14 59.43,103.14 DCDC1.4
PWM1: length 13.8
  Bottom Layer w0.457: MSPJ4J1.2 44.93,21.77 TB6612_1.1
PWM2: length 18
  Bottom Layer w0.457: MSPJ4J1.1 45.53,17.94 TB6612_1.7
RST: length 102.5
  Top Layer w0.457: MSPJ4J1.16 37.66,24.66 37.66,18.25 35.09,15.68 32.04,15.68 26.84,10.47 26.84,6.15 25.57,4.88 21.89,4.88 19.98,6.79
  Bottom Layer w0.457: MSPJ4J1.16 39.9,28.09 22.43,45.57 22.43,64.8 RST.1
RX: length 184.1
  Top Layer w0.457: v2(15.28,27.49) 15.28,41.2 18.97,44.89 23.16,44.89 27.24,48.97 28.15,48.97 35.62,56.44 35.62,65.23 v2(40.81,70.41) ; 80.05,63.39 v2(80.05,46.67) ; 80.05,63.39 81.61,64.95 H7.1 ; 80.05,63.39 78.49,64.95 H6.1 ; v2(90.85,43.62) 90.97,43.49 v2(90.97,25.58)
  Bottom Layer w0.457: MSPJ1J3.3 88.31,22.92 v2(90.97,25.58) ; H7.1 H6.1 75.12,64.95 68.14,71.94 42.33,71.94 v2(40.81,70.41) ; UARTSCREEN_1.3 2.84,18.06 2.84,19.66 3.69,20.51 10.18,20.51 12.64,22.98 ; v2(90.85,43.62) 89.32,45.14 81.57,45.14 v2(80.05,46.67) ; BLUETOOTH_1.2 15.28,25.62 v2(15.28,27.49)
SCREEN_SEL: length 55.7
  Top Layer w0.457: UARTSCREEN_1.1 4.22,23.01
  Top Layer w0.508: UARTSCREEN.2 6.9,46.03 6.9,29.14 4.22,26.46 4.22,23
SPICLK: length 189.8
  Top Layer w0.457: v2(60.37,73.33) 60.37,48.7 49.91,38.24 49.91,18.3 33.7,2.09 19.6,2.09 14.9,6.78 ; v2(95,37.41) 95.42,37.41 97.67,39.65 97.67,39.89 98.57,40.79 98.57,70.39 96.39,72.57 83.86,72.57
  Bottom Layer w0.457: MSPJ1J3.7 91.37,37.41 v2(95,37.41) ; 83.86,72.57 76.37,72.57 72.81,76.13 62.27,76.13 60.37,74.22 v2(60.37,73.33)
SPIMISO: length 79.2
  Top Layer w0.457: v2(44.62,43.11) 44.72,43.11 45.51,43.9 ; 45.51,43.87 45.51,50.55 56.54,61.58 57.05,61.58
  Bottom Layer w0.457: MSPJ4J1.14 39.57,34.7 39.57,41.35 41.33,43.11 v2(44.62,43.11) ; v2(57.05,61.58) 73.68,61.58 75.81,63.71 84.84,63.71 85.11,63.97 85.11,66.25 H11.3 H10.3
SPIMOSI: length 124.3
  Top Layer w0.457: MSPJ4J1.15 40.53,30.63 v2(25.95,16.06) ; v2(53.13,40.31) 61.51,48.7 v2(61.51,72.83)
  Bottom Layer w0.457: OLED_1.4 17.44,7.55 v2(25.95,16.06) ; v2(53.13,40.31) 48.99,44.45 41.55,44.45 38.84,41.75 38.84,32.89 MSPJ4J1.15 ; v2(61.51,72.83) 61.51,73.33 62.65,74.48 71.92,74.48 H10.2 H11.2
SPISET: length 36.6
  Top Layer w0.457: MSPJ4J1.13 22.52,17.14 OLED_1.6
SW1: length 109.8
  Top Layer w0.457: v2(93.53,48.3) 93.34,48.11 v2(93.34,26.06) ; v2(38.52,59.49) 37.25,58.22 37.25,53.14 31.16,47.05 FUNCTION_SEL2.2 28.36,47.55
  Bottom Layer w0.457: v2(38.52,59.49) 42.76,59.49 54.43,47.83 63.46,47.83 63.94,48.3 v2(93.53,48.3) ; MSPJ1J3.2 87.65,20.38 v2(93.34,26.06)
SW2: length 113.4
  Top Layer w0.457: v2(97.25,37.12) 95.03,34.9 v2(95.03,30.54) ; v2(46.27,48.57) v2(50.84,53.14) ; FUNCTION_SEL1.2 24.23,47.05 v2(25.69,48.51)
  Bottom Layer w0.457: 97.25,37.12 97.25,53.64 97.02,53.87 51.56,53.87 v2(50.84,53.14) ; v2(46.27,48.57) 46.2,48.51 v2(25.69,48.51) ; MSPJ1J3.6 v2(95.03,30.54)
TB6612_1_10: length 66.1
  Top Layer w1.016: MOTOR_4.1 97.48,56.29 97.48,41.49 MOTOR_3.1
  Bottom Layer w1.016: TB6612_1.10 78.09,6.53 96.1,24.54 96.1,39.51 MOTOR_3.1
TB6612_1_11: length 78.4
  Top Layer w1.016: 72.44,9.2 80.68,9.2 89.7,18.22 89.7,48.18 94.16,52.63 ; 94.16,52.51 95.8,52.51 95.8,54.14 94.13,55.81 94.13,69 MOTOR_4.6
TB6612_1_12: length 108.7
  Top Layer w1.016: 3.47,57.84 3.47,56.2 1.88,54.61 1.88,41.53 MOTOR_1.6
  Bottom Layer w1.016: MOTOR_1.6 5.4,39.81 44.19,1.02 61.84,1.02 TB6612_1.12
TB6612_1_13: length 113.9
  Top Layer w1.016: 3.6,52.51 5.15,54.06 5.15,68.86 MOTOR_2.1
  Bottom Layer w1.016: TB6612_1.13 60.62,2.34 55.16,2.34 48.56,8.95 47.59,8.95 4.03,52.51 3.6,52.51
TRCT1: length 12.7
  Bottom Layer w0.457: TARC_1.3 53.54,38.25 MSPJ4J1.9
TRCT2: length 57.8
  Top Layer w0.457: 43.63,40.79 43.78,40.94 43.78,78.49 TARC_2.3
TRCT3: length 54.1
  Top Layer w0.457: v2(42.97,72.95) 42.97,42.67 41.09,40.79 ; TARC_3.3 45.63,91.75 v2(45.63,75.75)
  Bottom Layer w0.457: v2(42.97,72.95) 42.97,73.08 v2(45.63,75.75)
TRCT4: length 66
  Top Layer w0.457: MSPJ4J1.7 59.22,48.76 59.22,92.77
TRCT5: length 33.2
  Top Layer w0.457: v2(64.56,30.92) 67.1,30.92 TARC_5.3
  Bottom Layer w0.457: MSPJ4J1.8 48.43,30.92 v2(64.56,30.92)
TX: length 206.7
  Top Layer w0.457: v2(41.95,60.25) 40.81,60.25 39.03,58.47 39.03,42.98 18.71,22.66 v2(18.58,22.66) ; v2(98.43,39.58) 98.43,31.85 v2(95.03,28.45)
  Bottom Layer w0.457: MSPJ1J3.4 88.62,27.04 94.37,27.04 95.03,27.69 v2(95.03,28.45) ; v2(41.95,60.25) 51.09,60.25 ; 51.09,60.25 54.65,57.21 ; 51.09,60.25 47.28,60.25 ; 12.65,20.12 BLUETOOTH_1.3 ; v2(18.58,22.66) 16.42,20.5 12.64,20.5 12.64,20.11 12.23,20.11 11.33,19.22 UARTSCREEN_1.2 ; 54.65,57.21 57.19,58.48 75.04,58.63 ; 54.65,57.21 54.67,55.76 55.8,54.65 97.3,54.65 98.43,53.52 98.43,39.58 ; 76.37,62.41 83.86,62.41 85.11,61.17 85.11,58.89 84.84,58.63 75.04,58.63

## Copper pours and planes (outline as drawn; the poured copper is in the pictures)
GND on Top Layer: 119.55,-10.61 244.77,-10.61 268.14,-33.98 268.14,-150.19 245.15,-173.17 114.72,-173.17 111.04,-169.49 111.04,-55.95 109.39,-54.3
GND on Bottom Layer: 41.7,63.17 83.61,63.17 99.1,47.68 38.52,47.68 38.4,47.81
GND on Bottom Layer: 131.49,-34.36 256.07,-34.36 280.84,-59.13 280.84,-171.52 258.11,-194.25 123.1,-194.25 121.71,-192.86

## Text on the board
Top Silkscreen Layer: 0.96'OLED SPI | on | off

# Board 2-PCB_PCB_MSP430_T2_pro
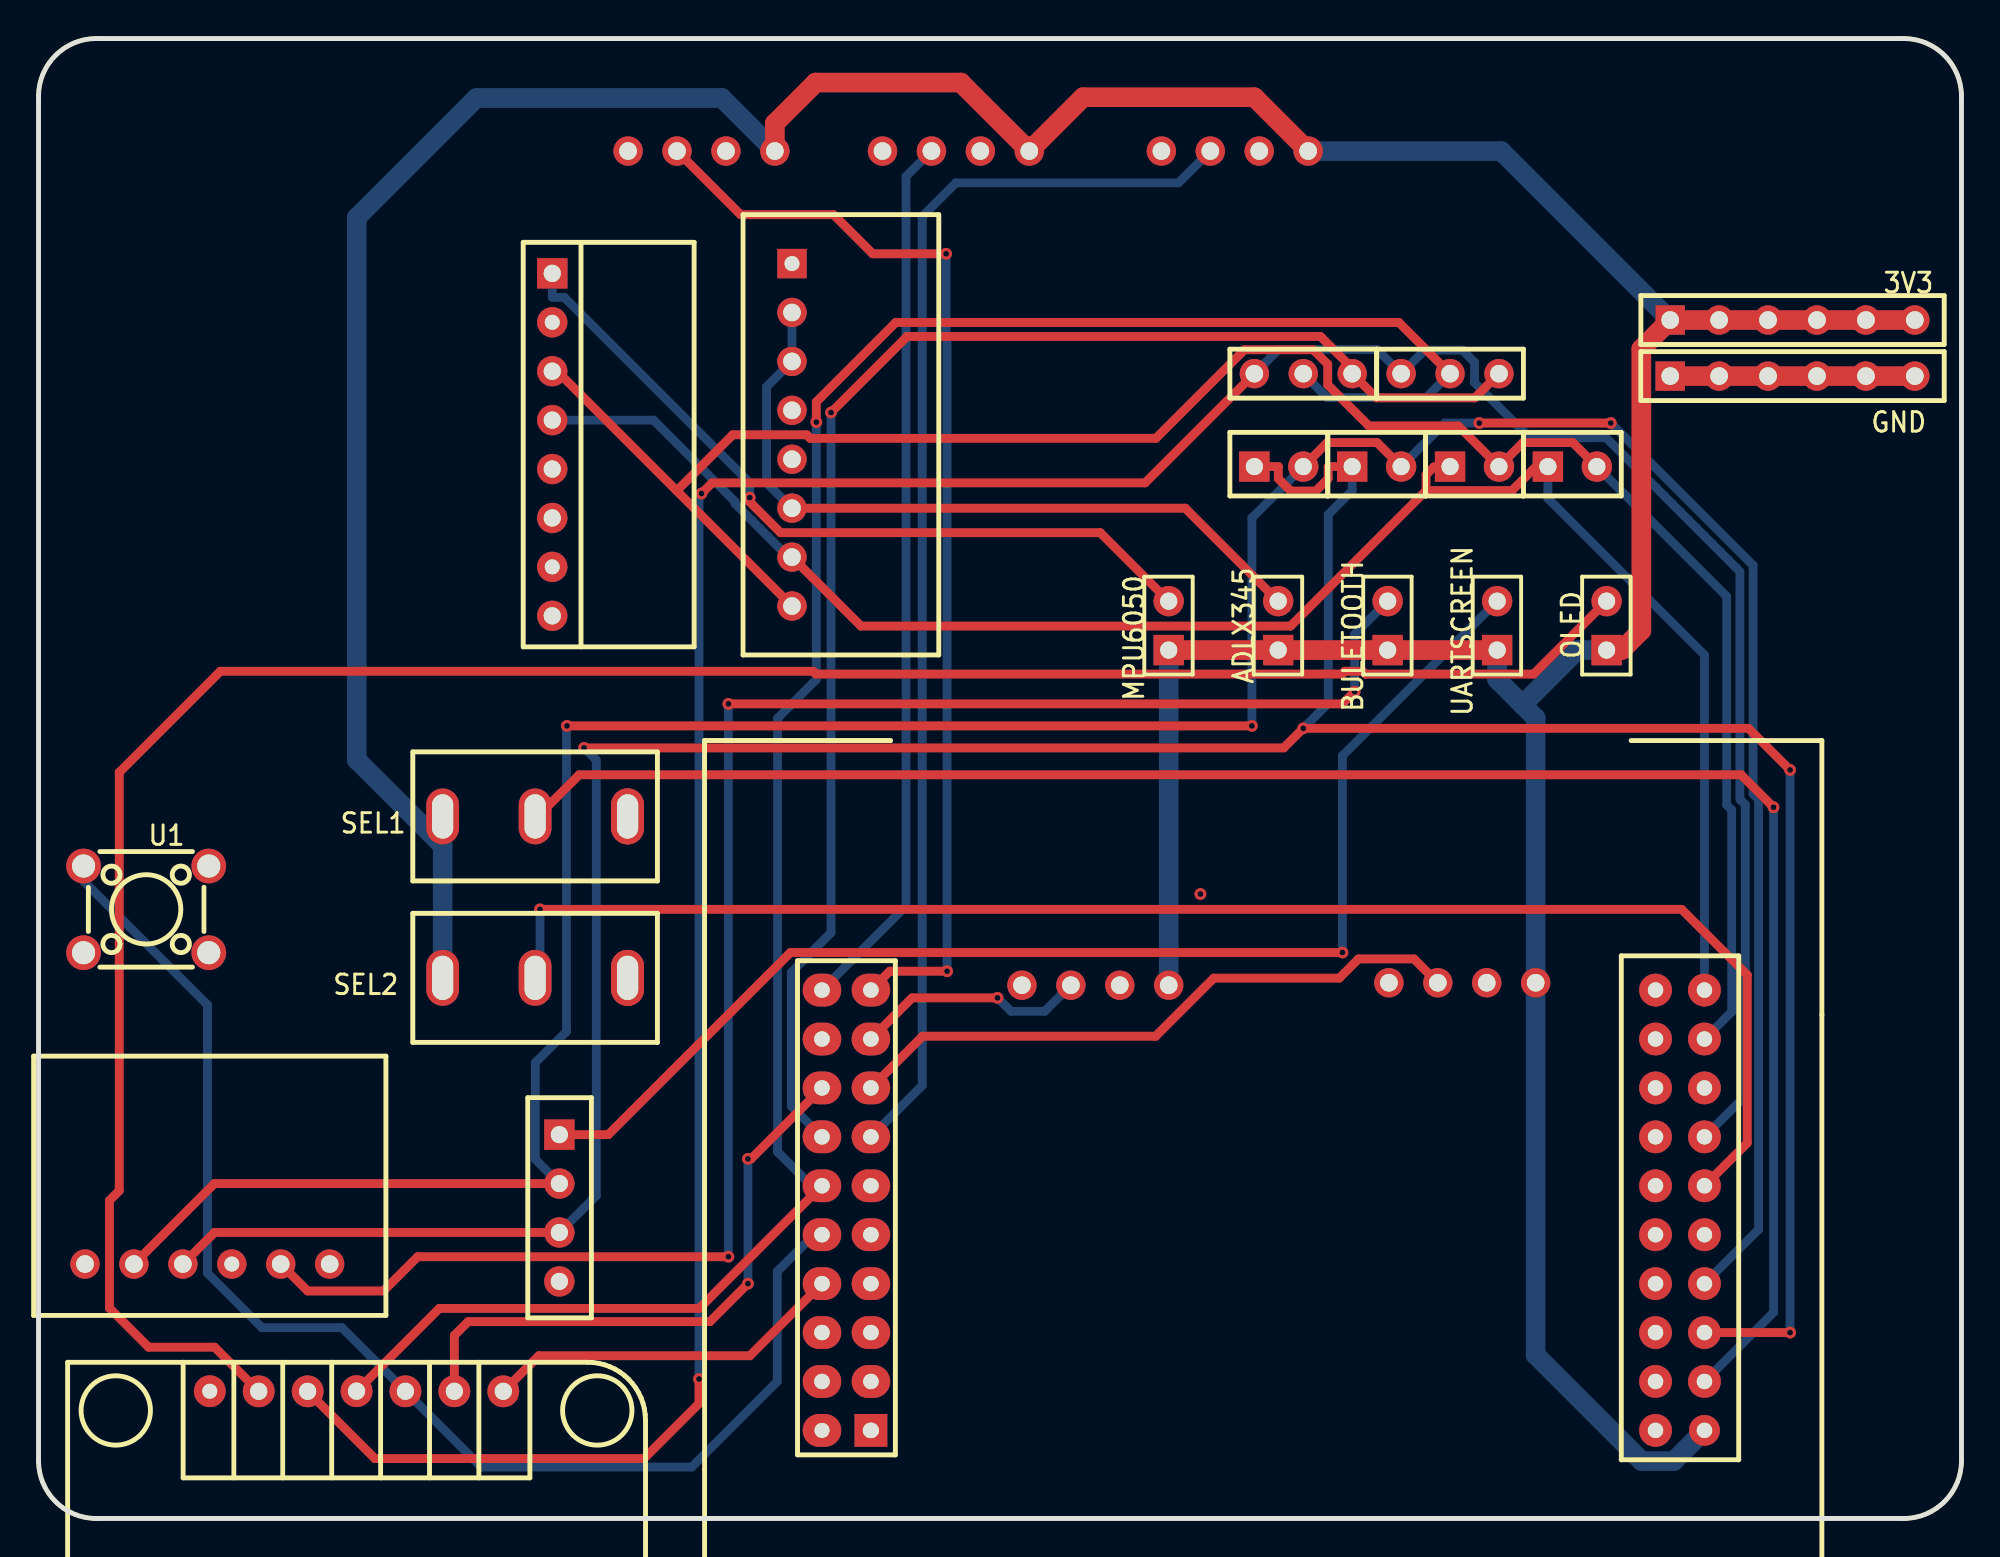
[diagram p3: board, top side]
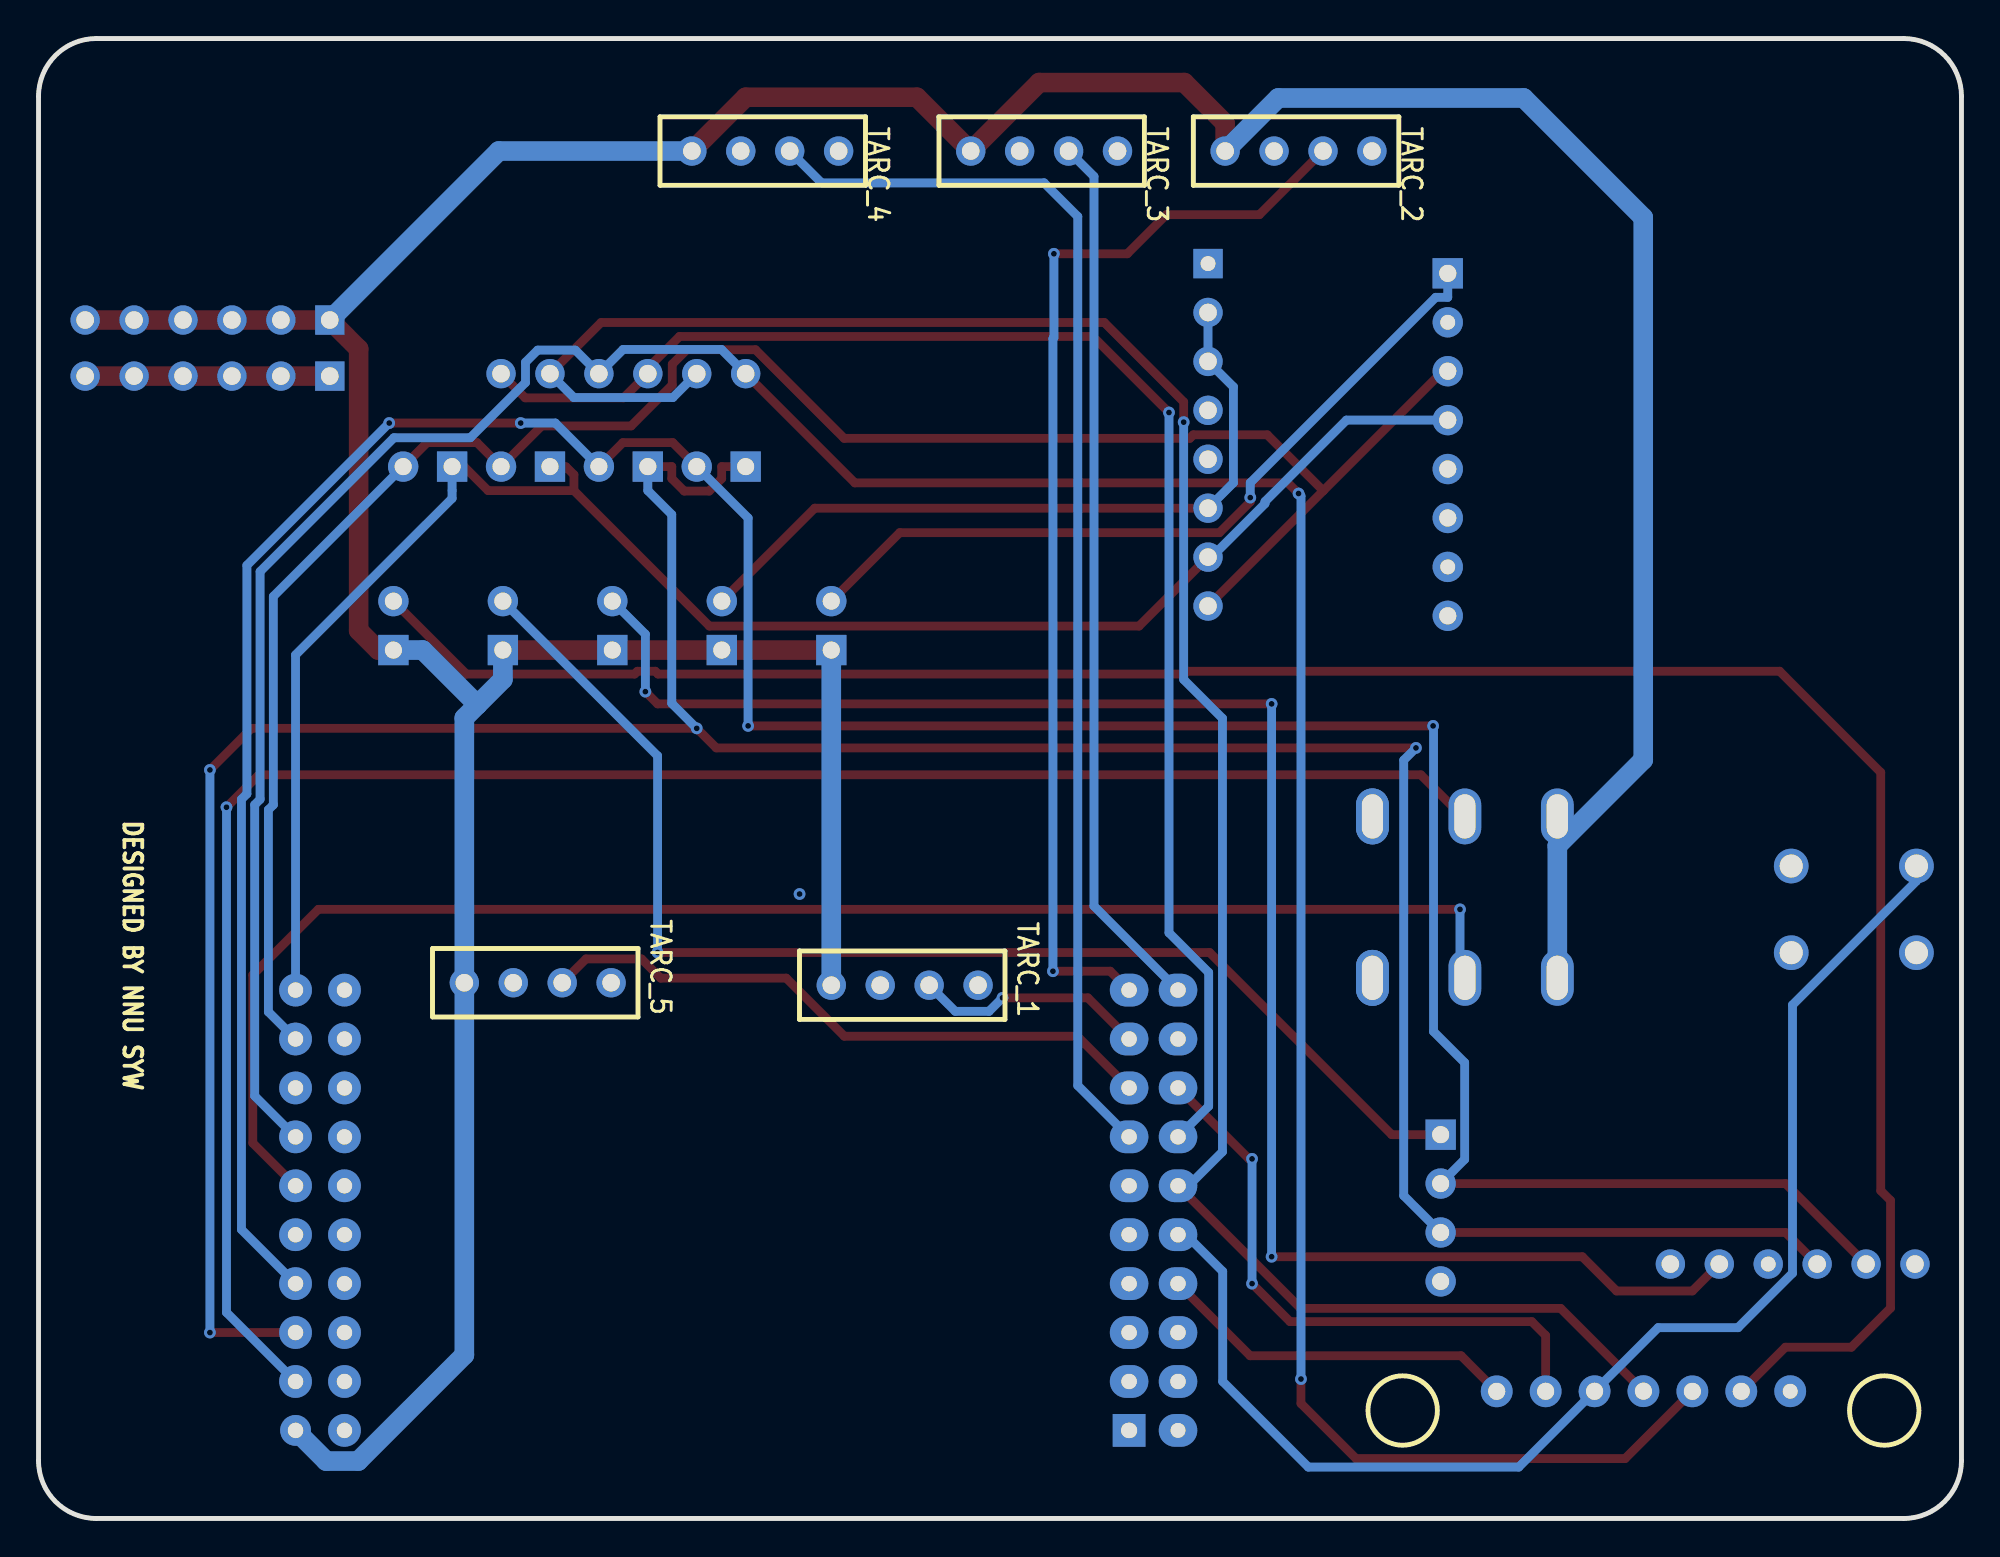
[diagram p4: board, bottom side, seen from below]

Outline 99.83 x 76.84 mm; copper layers: Top Layer, Bottom Layer. Coordinates in mm from the lower left corner of the outline.
Outline path: 0,73.84 0,3 arc(0.88,0.88) 3,0 96.83,0 arc(98.95,0.88) 99.83,3 99.83,73.84 arc(98.95,75.96) 96.83,76.84 3,76.84 arc(0.88,75.96) 0,73.84
Stack: Top Layer 0.035mm / Dielectric1 1.51mm FR4 er 4.5 / Bottom Layer 0.035mm

## Design rules (mm)
spacing Default (default): track to track 0.228, other pairs 0 to 0.228
spacing DY: track to track 0.228, other pairs 0 to 0.228
track width Default (default): min 0.457, default 0.457, max 25.4
track width DY: min 1.016, default 1.016, max 25.4
differential pair differentialPair (default): width min 0.127, default 0.254, max 2.54; gap min 0.152, default 0.152
via Default (default): diameter min 0.61, default 0.61, max 100.025; hole min 0.305, default 0.305, max 59.995
via DY: diameter min 0.61, default 0.61, max 100.025; hole min 0.305, default 0.305, max 59.995
net 3V3 uses DY
net GND uses DY, gge13235
net TB6612_1_13 uses DY
pour e481 uses gge13235

## Placement (name value [footprint] x y rotation side)
3V3  3V3  [DIP-6P]  92.33 62.22 0 top
ADLX345  ADXL_SEL  [HDR-F-2.54_1X2]  64.36 46.36 90 top
ADXL345_1  ADXL345  [ADXL345加速度模块]  36.58 67.69 0 top
BLUETOOTH_1  BLUETOOTH  [HC05封装]  4.95 13.21 90 top
BULETOOTH  BLUETOOTH_SEL  [HDR-F-2.54_1X2]  70.04 46.36 90 top
GND  GND  [DIP-6P]  92.33 59.31 0 top
H6  UART  [UART_2]  64.39 54.61 0 top
H7  UART  [UART_2]  69.47 54.61 0 top
H8  I2C  [DIP-2.54MM-2P]  74.55 54.61 0 top
H9  I2C  [DIP-2.54MM-2P]  79.63 54.61 0 top
H10  OLED  [SPI_3]  73.28 59.44 0 top
H11  OLED  [SPI_3]  65.66 59.44 0 top
MPU6050  MPU6050_SEL  [HDR-F-2.54_1X2]  58.67 46.36 90 top
MPU6050_1  MPU6050  [MPU6050模块]  26.67 46.86 0 top
MSPJ1J3  J1J3  [MSP_L]  82.68 16 180 top
MSPJ4J1  J4J2  [MSP_R]  43.21 4.57 180 top
NOREF  -  [Pad_e834]  30.58 36.45 0 top
NOREF#2  -  [Pad_e835]  30.58 28.07 0 top
OLED  OLED_SEL  [HDR-F-2.54_1X2]  81.41 46.36 90 top
OLED_1  OLED  [0.96OLED_7P]  16.51 6.6 0 top
SEL1  SS12D10G4 071  [SW-TH_SHOU-HAN_SS12D10G4]  25.78 36.45 0 top
SEL2  SS12D10G4 071  [SW-TH_SHOU-HAN_SS12D10G4]  25.78 28.07 0 top
TARC_1  -  [TARC]  54.86 27.69 90 bottom
TARC_2  -  [TARC]  34.42 70.99 90 bottom
TARC_3  -  [TARC]  47.62 70.99 90 bottom
TARC_4  -  [TARC]  62.1 70.99 90 bottom
TARC_5  -  [TARC]  73.91 27.81 90 bottom
U1  6*6轻触开关  [轻触开关6*6]  5.59 31.62 0 top
UARTSCREEN  UARTSCREEN_SEL  [HDR-F-2.54_1X2]  75.72 46.36 90 top
UARTSCREEN_1  UARTSCREEN  [UART_SCREEN]  26.67 16.51 0 top

## Footprints (pads in the part's own frame, mm; a bottom-side part is the same pattern mirrored in y, then rotated)
0.96OLED_7P
  round 1.65 hole 0.775: 1(-7.619,0.002)
  round 1.65 hole 0.89: 2(-5.079,-0.004) 3(-2.538,-0.004) 4(0.002,0.004) 5(2.538,-0.002) 6(5.079,-0.002) 7(7.619,-0.004)
ADXL345加速度模块
  rect 1.524x1.524 hole 0.775: 1(2.54,-2.54)
  round 1.524 hole 0.914: 2(2.54,-5.08) 3(2.54,-7.62) 4(2.54,-10.16) 5(2.54,-12.7) 6(2.54,-15.24) 7(2.54,-17.78) 8(2.54,-20.32)
DIP-2.54MM-2P
  rect 1.575x1.575 hole 0.889: 1(-1.27,0)
  round 1.575 hole 0.889: 2(1.27,0)
DIP-6P
  rect 1.524x1.524 hole 0.914: 1(-7.62,0)
  round 1.524 hole 0.914: 2(-5.08,0) 3(-2.54,0) 4(0,0) 5(2.54,0) 6(5.08,0)
HC05封装
  round 1.524 hole 0.914: 1(0,2.54) 2(0,0) 3(0,-2.54) 5(0,-7.62) 6(0,-10.16)
  round 1.524 hole 0.775: 4(0,-5.08)
HDR-F-2.54_1X2
  rect 1.575x1.575 hole 0.889: 1(-1.27,0)
  round 1.575 hole 0.889: 2(1.27,0)
MPU6050模块
  rect 1.575x1.575 hole 0.889x0.894: 1(0,17.78)
  round 1.575 hole 0.775: 2(0,15.24) 7(0,2.54)
  round 1.575 hole 0.889x0.894: 3(0,12.7) 4(0,10.16) 5(0,7.62) 6(0,5.08) 8(0,0)
MSP_L
  round 1.6 hole 0.8: 1(-3.81,11.43)
  round 1.7 hole 0.8: 2(-3.81,8.89) 3(-3.81,6.35) 4(-3.81,3.81) 5(-3.81,1.27) 6(-3.81,-1.27) 7(-3.81,-3.81) 8(-3.81,-6.35) 9(-3.81,-8.89) 10(-3.81,-11.43) 11(-1.27,-11.43) 12(-1.27,-8.89) 13(-1.27,-6.35) 14(-1.27,-3.81) 15(-1.27,-1.27) 16(-1.27,1.27) 17(-1.27,3.81) 18(-1.27,6.35) 19(-1.27,8.89) 20(-1.27,11.43)
MSP_R
  rect 1.7x1.7 hole 0.84x0.8: 1(0,0)
  oval 2x1.7 hole 0.805x0.8: 2(0,-2.54) 3(0,-5.08) 4(0,-7.62) 5(0,-10.16) 6(0,-12.7) 7(0,-15.24) 8(0,-17.78) 9(0,-20.32) 10(0,-22.86) 11(2.54,-22.86) 12(2.54,-20.32) 13(2.54,-17.78) 14(2.54,-15.24) 15(2.54,-12.7) 16(2.54,-10.16) 17(2.54,-7.62) 18(2.54,-5.08) 19(2.54,-2.54)
  oval 2x1.7 hole 0.775: 20(2.54,0)
Pad_e834
  oval 1.7x2.9 hole 1.1x2.3: 2(0,0)
Pad_e835
  oval 1.7x2.9 hole 1.1x2.3: 2(0,0)
SPI_3
  round 1.524 hole 0.914: 1(-2.54,0) 2(0,0) 3(2.54,0)
SW-TH_SHOU-HAN_SS12D10G4
  oval 1.7x2.9 hole 1.1x2.3: 1(-4.8,0) 2(0,0)
  oval 1.7x2.9 hole 0.775: 3(4.8,0)
TARC
  round 1.524 hole 0.914: 1(0,3.81) 2(0,1.27) 3(0,-1.27) 4(0,-3.81)
UART_2
  rect 1.575x1.575 hole 0.889: 1(-1.27,0)
  round 1.575 hole 0.889: 2(1.27,0)
UART_SCREEN
  rect 1.575x1.575 hole 0.889: 1(0.368,3.417)
  round 1.575 hole 0.889: 2(0.368,0.876) 3(0.368,-1.663) 4(0.368,-4.204)
轻触开关6*6
  round 1.8 hole 1.2: 1(-3.25,2.25) 2(3.25,2.25) 3(-3.25,-2.25) 4(3.25,-2.25)

## Nets
3V3: 3V3.1 3V3.2 3V3.3 3V3.4 3V3.5 3V3.6 ADLX345.1 BULETOOTH.1 MPU6050.1 MSPJ1J3.1 OLED.1 SEL1.1 SEL2.1 TARC_1.1 TARC_2.1 TARC_3.1 TARC_4.1 TARC_5.1 UARTSCREEN.1
GND: ADXL345_1.1 BLUETOOTH_1.4 GND.1 GND.2 GND.3 GND.4 GND.5 GND.6 MPU6050_1.2 MPU6050_1.7 MSPJ1J3.19 MSPJ4J1.20 NOREF.2 NOREF#2.2 OLED_1.1 SEL1.3 SEL2.3 TARC_1.2 TARC_2.2 TARC_3.2 TARC_4.2 TARC_5.2 U1.3 UARTSCREEN_1.4
ADXL_SEL: ADLX345.2 ADXL345_1.2 ADXL345_1.3 ADXL345_1.6
BT_SEL: BLUETOOTH_1.5 BULETOOTH.2
CODE1B: MSPJ1J3.8
CODE1G: MSPJ4J1.18
CODE2B: MSPJ1J3.5
CODE2G: MSPJ4J1.3
I2CSCL: ADXL345_1.8 H8.2 H9.2 MPU6050_1.3 MSPJ1J3.9
I2CSDA: ADXL345_1.7 H8.1 H9.1 MPU6050_1.4 MSPJ1J3.10
L1OUT1: MSPJ1J3.12
L1OUT2: MSPJ1J3.11
L2OUT1: MSPJ1J3.14
L2OUT2: MSPJ1J3.13
MPU_SEL: MPU6050.2 MPU6050_1.1
OLED_CS: MSPJ4J1.17 OLED_1.7
OLED_SEL: OLED.2 OLED_1.2
PWM1: MSPJ4J1.2
PWM2: MSPJ4J1.1
RST: MSPJ4J1.16 OLED_1.5 U1.1
RX: BLUETOOTH_1.3 H6.1 H7.1 MSPJ1J3.3 UARTSCREEN_1.3
SCREEN_SEL: UARTSCREEN.2 UARTSCREEN_1.1
SPICLK: H10.1 H11.1 MSPJ1J3.7 OLED_1.3
SPIMISO: H10.3 H11.3 MSPJ4J1.14
SPIMOSI: H10.2 H11.2 MSPJ4J1.15 OLED_1.4
SPISET: MSPJ4J1.13 OLED_1.6
SW1: MSPJ1J3.2 SEL1.2
SW2: MSPJ1J3.6 SEL2.2
TRCT1: MSPJ4J1.9 TARC_1.3
TRCT2: MSPJ4J1.10 TARC_2.3
TRCT3: MSPJ4J1.11 TARC_3.3
TRCT4: MSPJ4J1.7 TARC_4.3
TRCT5: MSPJ4J1.8 TARC_5.3
TX: BLUETOOTH_1.2 H6.2 H7.2 MSPJ1J3.4 UARTSCREEN_1.2

Pads without a net: ADXL345_1 4 5; BLUETOOTH_1 1 6; MPU6050_1 5 6 8; MSPJ1J3 15 16 17 18 20; MSPJ4J1 4 5 6 12 19; TARC_1 4; TARC_2 4; TARC_3 4; TARC_4 4; TARC_5 4; U1 2 4

## Via types
v1: diameter 0.61, hole 0.305, Top Layer to Bottom Layer, 25 vias

## Routing (per net, layer and track width the routed paths; a pad name or vN(x,y) marks a point on that pad's centre or on a via; arc(x,y) is an arc through that point)
3V3: length 243.8
  Top Layer w1.016: UARTSCREEN.1 BULETOOTH.1 ADLX345.1 MPU6050.1 ; 97.41,62.22 3V3.5 3V3.4 3V3.2 3V3.1 83.21,60.72 83.21,46.1 82.19,45.09 OLED.1 ; TARC_4.1 63.12,73.79 54.23,73.79 TARC_3.1 47.88,74.55 40.35,74.55 38.23,72.43 TARC_2.1
  Bottom Layer w1.016: TARC_1.1 MPU6050.1 ; 3V3.1 75.94,70.99 TARC_4.1 ; OLED.1 79.88,45.09 77.04,42.24 ; TARC_2.1 35.47,73.75 22.73,73.75 16.52,67.54 16.52,39.39 20.98,34.93 20.98,28.19 21.11,28.07 ; 77.04,42.24 75.72,43.56 UARTSCREEN.1 ; 77.04,42.24 77.72,41.56 TARC_5.1 77.72,8.49 83.23,2.98 84.9,2.98 MSPJ1J3.1
GND: length 12.7
  Top Layer w1.016: GND.1 GND.2 GND.4 GND.5 97.41,59.31
ADXL_SEL: length 38.5
  Top Layer w0.457: ADLX345.2 59.53,52.45 ADXL345_1.6
  Bottom Layer w0.457: ADXL345_1.2 ADXL345_1.3 37.8,58.75 37.8,53.77 ADXL345_1.6
BT_SEL: length 91.4
  Top Layer w0.457: v1(35.81,42.29) 67.69,42.29 v1(68.33,42.93) ; 12.57,13.21 13.97,11.81 17.91,11.81 19.69,13.59 v1(35.81,13.59)
  Bottom Layer w0.457: v1(35.81,13.59) v1(35.81,42.29) ; v1(68.33,42.93) 68.33,45.91 BULETOOTH.2
I2CSCL: length 105.8
  Top Layer w0.457: H9.2 79.65,55.86 77.06,55.86 H8.2 73.71,56.72 69.06,56.72 66.93,58.86 66.93,59.92 66.18,60.68 62.6,60.68 58,56.08 40.06,56.08 39.88,56.26 36.04,56.26 33.13,53.36 ; ADXL345_1.8 33.13,53.36 ; 33.13,53.36 26.92,59.56 MPU6050_1.3
  Bottom Layer w0.457: H9.2 87.64,47.87 87.64,37.05 87.9,36.79 87.9,26.3 MSPJ1J3.9
I2CSDA: length 92.4
  Top Layer w0.457: 72.03,53.37 65,46.33 42.7,46.33 ADXL345_1.7 ; 72.03,53.37 76.49,53.37 77.74,54.61 78.36,54.61 ; 72.03,53.37 72.03,54.19 72.44,54.6 H8.1
  Bottom Layer w0.457: ADXL345_1.7 38.93,49.91 36.16,52.69 36.16,52.79 31.93,57.02 MPU6050_1.4 ; MSPJ1J3.10 86.49,44.83 78.36,52.96 78.36,54.61
MPU_SEL: length 40.4
  Top Layer w0.457: MPU6050.2 55.12,51.18 38.52,51.18 36.92,52.78 v1(36.92,53)
  Bottom Layer w0.457: v1(36.92,53) 36.92,53.77 27.29,63.4 26.67,63.4 MPU6050_1.1
OLED_CS: length 18.9
  Top Layer w0.457: MSPJ4J1.17 36.93,8.45 25.98,8.45 OLED_1.7
OLED_SEL: length 118.7
  Top Layer w0.457: OLED_1.2 9.14,8.89 5.72,8.89 3.68,10.92 3.68,16.51 4.19,17.02 4.19,38.74 9.44,43.99 40.21,43.99 40.35,43.84 67.67,43.84 67.81,43.99 68.74,43.99 68.88,43.84 77.62,43.84 OLED.2
RST: length 68.2
  Bottom Layer w0.457: U1.1 2.34,33.1 8.77,26.66 8.77,12.73 11.6,9.91 15.75,9.91 OLED_1.5 22.98,2.67 33.91,2.67 38.35,7.11 38.35,12.83 40.26,14.73 40.67,14.73
RX: length 165.5
  Top Layer w0.457: 7.49,13.21 9.13,14.85 UARTSCREEN_1.3 ; v1(90.93,9.65) MSPJ1J3.3 ; H6.1 64.36,54.61 64.36,53.99 65.01,53.34 66.31,53.34 66.95,53.99 66.95,54.61 68.2,54.61 ; v1(90.93,38.86) 88.77,41.02 v1(65.66,41.02) 64.64,40.01 v1(28.32,40.01)
  Bottom Layer w0.457: v1(65.66,41.02) 66.96,42.32 66.96,52.12 68.2,53.37 68.2,54.61 ; v1(28.32,40.01) 28.96,39.37 28.96,16.76 UARTSCREEN_1.3 ; v1(90.93,9.65) v1(90.93,38.86)
SCREEN_SEL: length 66.1
  Top Layer w0.457: UARTSCREEN_1.1 29.58,19.93 39.03,29.38 v1(67.69,29.38)
  Bottom Layer w0.457: v1(67.69,29.38) 67.69,39.59 UARTSCREEN.2
SPICLK: length 164
  Top Layer w0.457: v1(34.42,53.21) 34.97,53.77 57.45,53.77 H11.1 ; OLED_1.3 17.46,3.11 31.43,3.11 34.29,5.97 v1(34.29,7.24)
  Bottom Layer w0.457: v1(34.29,7.24) 34.29,53.09 v1(34.42,53.21) ; H11.1 64.37,60.69 69.49,60.69 H10.1 71.96,60.66 73.92,60.66 74.55,60.03 74.55,58.97 77.41,56.11 81.38,56.11 88.33,49.16 88.33,37.34 88.61,37.05 88.61,21.93 MSPJ1J3.7
SPIMISO: length 77.4
  Top Layer w0.457: H10.3 74.56,58.18 69.46,58.18 68.2,59.44 68.2,59.72 66.55,61.37 45.09,61.37 v1(41.14,57.42)
  Bottom Layer w0.457: MSPJ4J1.14 39.08,21.4 39.08,28.35 41.14,30.41 v1(41.14,57.42)
SPIMOSI: length 115.7
  Top Layer w0.457: OLED_1.4 20.81,10.91 34.31,10.91 MSPJ4J1.15 ; H10.2 70.62,62.09 44.5,62.09 40.38,57.97 v1(40.38,56.92)
  Bottom Layer w0.457: H11.2 66.9,58.2 72.04,58.2 H10.2 ; v1(40.38,56.92) 40.38,43.56 38.37,41.54 38.37,19.04 40.13,17.27 MSPJ4J1.15
SPISET: length 31.1
  Top Layer w0.457: OLED_1.6 21.59,9.5 22.31,10.22 34.86,10.22 v1(36.83,12.19) ; MSPJ4J1.13 36.99,18.67 v1(36.83,18.67)
  Bottom Layer w0.457: v1(36.83,12.19) v1(36.83,18.67)
SW1: length 97.2
  Top Layer w0.457: 25.78,36.32 28.07,38.61 88.39,38.61 v1(90.07,36.93)
  Bottom Layer w0.457: v1(90.07,36.93) 90.07,10.7 MSPJ1J3.2
SW2: length 79.6
  Top Layer w0.457: MSPJ1J3.6 88.71,19.49 88.71,28.22 85.3,31.62 v1(26.03,31.62)
  Bottom Layer w0.457: 25.91,28.07 26.03,28.19 v1(26.03,31.62)
TB6612_1_13:
  vias: v1(60.32,32.42)
TRCT1: length 12.1
  Top Layer w0.457: v1(49.79,27.03) 45.35,27.03 MSPJ4J1.9
  Bottom Layer w0.457: TARC_1.3 52.24,26.33 50.49,26.33 v1(49.79,27.03)
TRCT2: length 57.8
  Top Layer w0.457: MSPJ4J1.10 44.19,28.41 v1(47.17,28.41) ; TARC_2.3 36.45,67.69 41.28,67.69 43.31,65.66 v1(47.12,65.66)
  Bottom Layer w0.457: v1(47.12,65.66) 47.12,61.31 47.17,61.26 v1(47.17,28.41)
TRCT3: length 45.9
  Bottom Layer w0.457: MSPJ4J1.11 45.04,31.8 45.04,69.67 TARC_3.3
TRCT4: length 65.2
  Bottom Layer w0.457: TARC_4.3 59.18,69.34 47.62,69.34 45.88,67.6 45.88,22.48 MSPJ4J1.7
TRCT5: length 32.7
  Top Layer w0.457: MSPJ4J1.8 45.9,25.04 58,25.04 61.01,28.05 67.53,28.05 68.53,29.05 71.41,29.05 TARC_5.3
TX: length 165.9
  Top Layer w0.457: BLUETOOTH_1.2 9.13,17.39 UARTSCREEN_1.2 ; H6.2 66.91,55.86 69.49,55.86 H7.2 ; v1(74.8,56.87) v1(81.62,56.87) ; v1(62.99,41.15) v1(27.43,41.15)
  Bottom Layer w0.457: v1(81.62,56.87) 89.01,49.48 89.01,37.62 89.29,37.34 89.29,15 MSPJ1J3.4 ; H6.2 62.99,51.94 v1(62.99,41.15) ; UARTSCREEN_1.2 25.79,18.64 25.79,23.67 27.41,25.28 27.41,41.12 v1(27.43,41.15) ; v1(74.8,56.87) 73,56.87 H7.2

## Copper pours and planes (outline as drawn; the poured copper is in the pictures)
GND on Top Layer: -144.65,90.3 -30.35,90.3 -18.16,78.11 -18.16,-17.65 -25.27,-24.76 -139.57,-24.76 -144.91,-19.43
GND on Bottom Layer: -222.12,88.65 -95.89,88.65 -86.49,79.25 -86.49,-18.03 -92.08,-23.62 -221.62,-23.62 -221.87,-23.88 -221.87,-15.75 -218.82,-12.7

## Text on the board
Bottom Silkscreen Layer: DESIGNED BY NNU SYW
